# EAGLE board fp_32_v1 (EAGLE 8.4.1), part 1 of 3
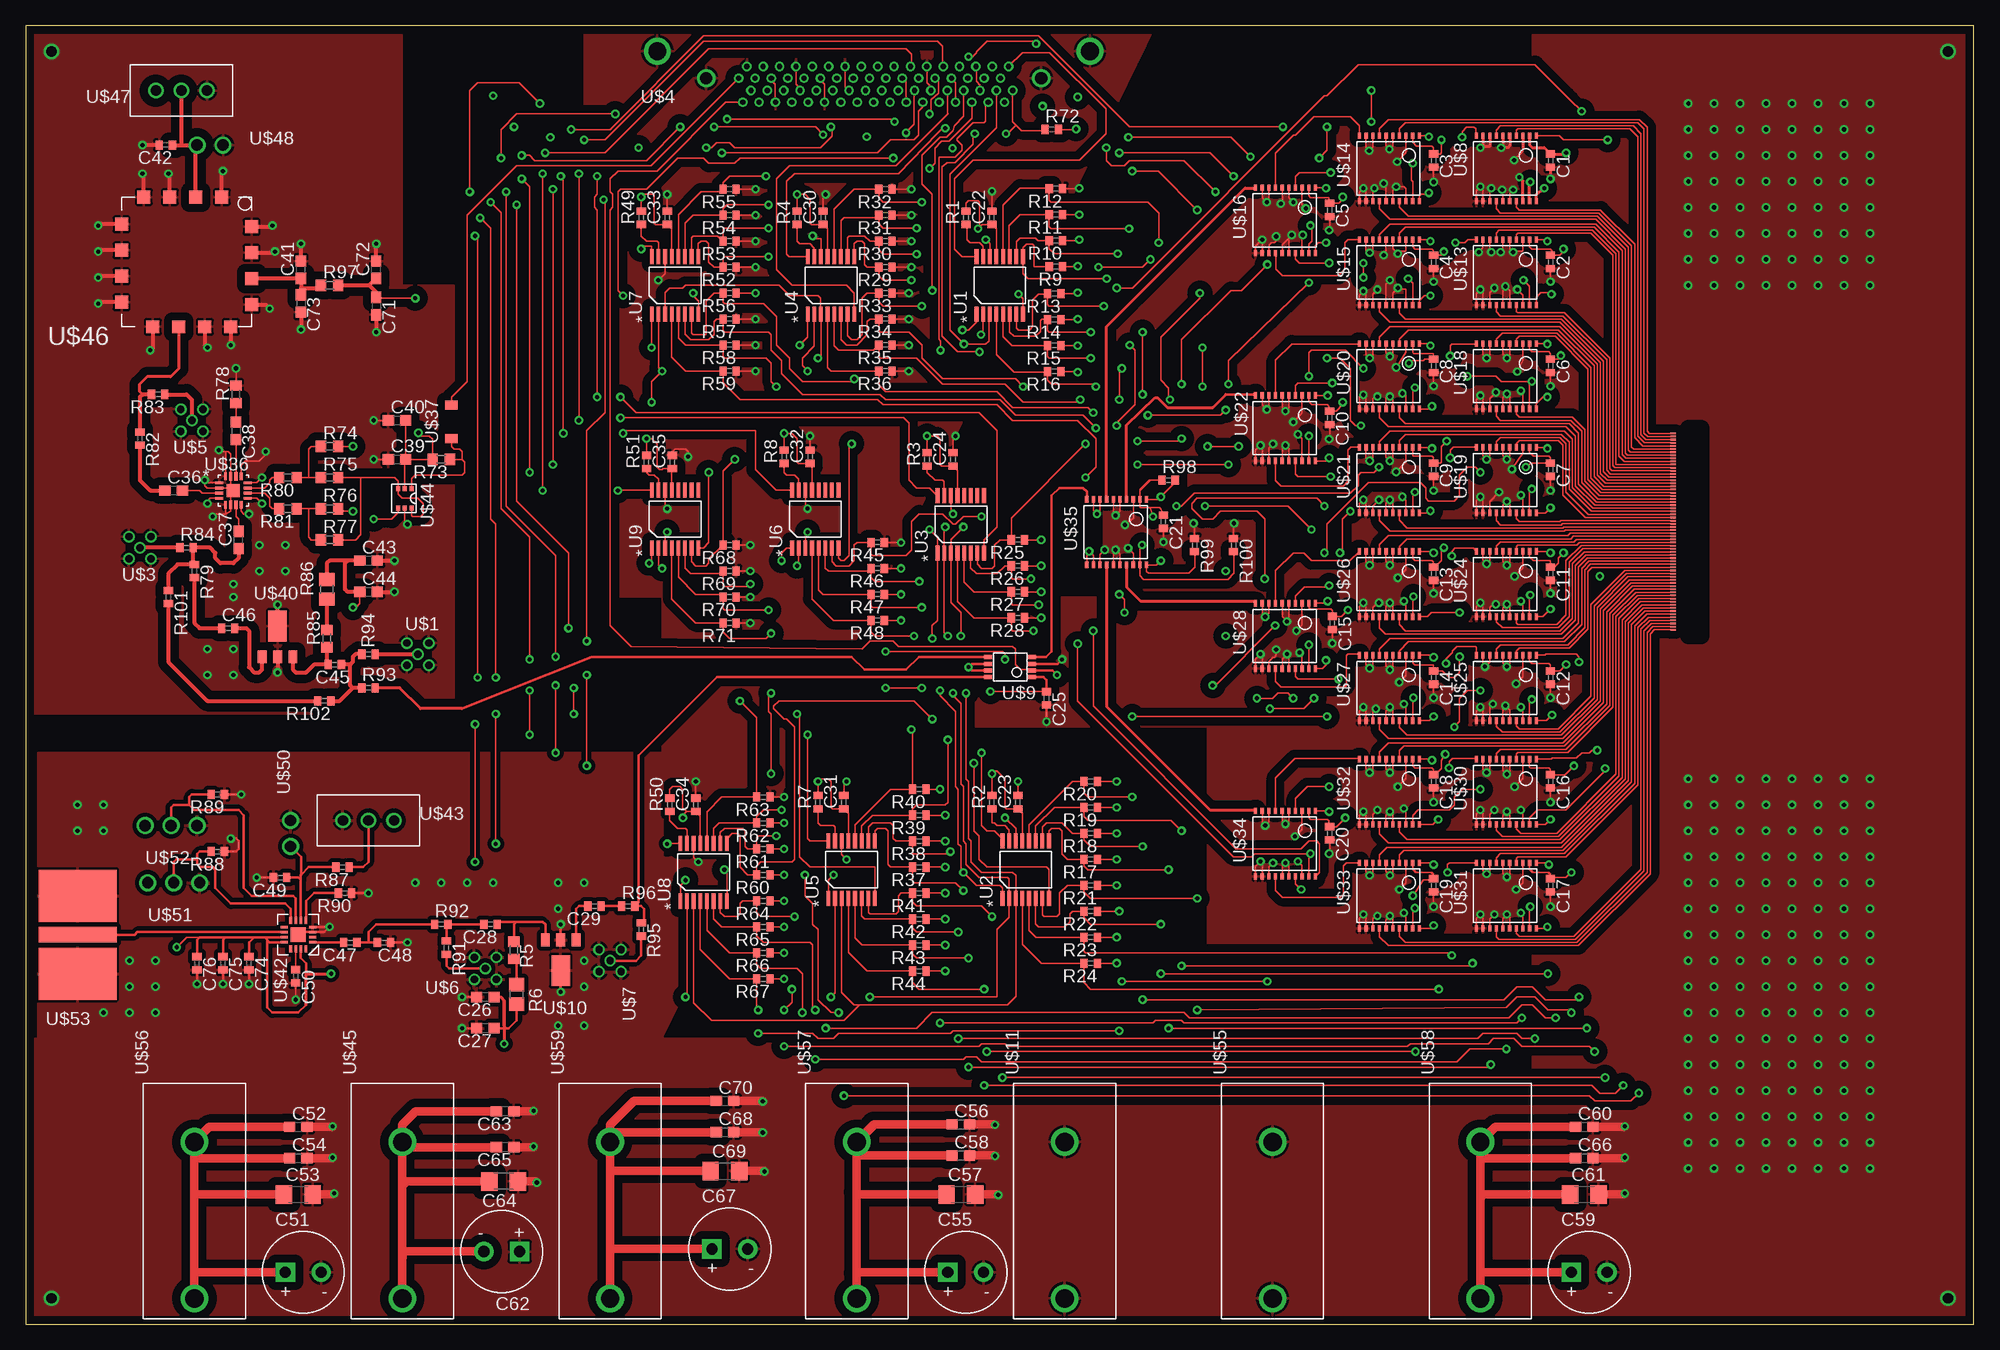
[diagram p14: board, top side]
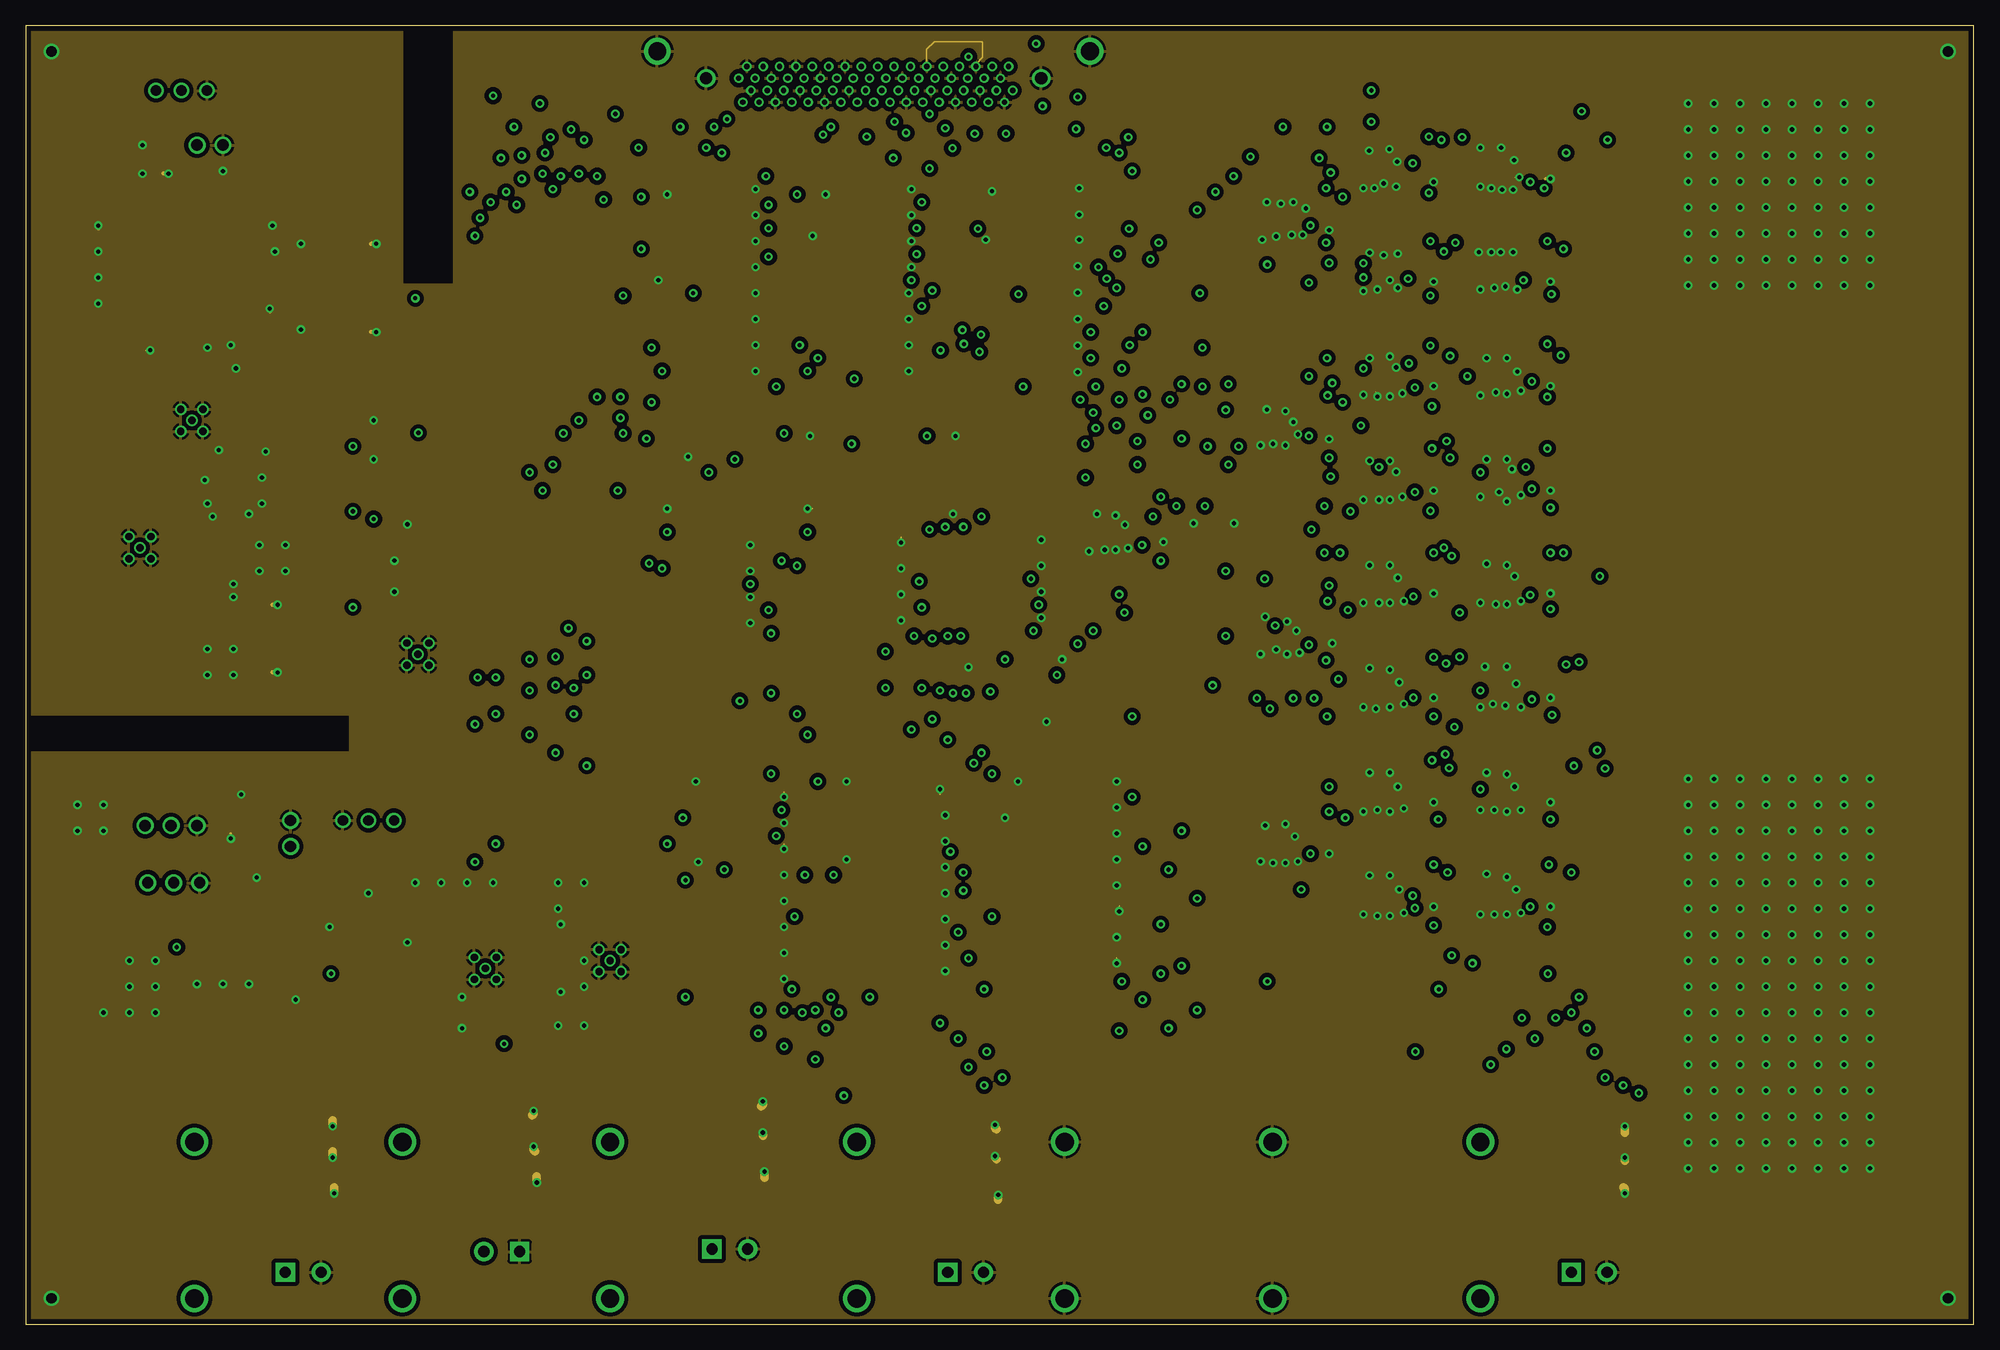
[diagram p15: board, inner layer Route2]
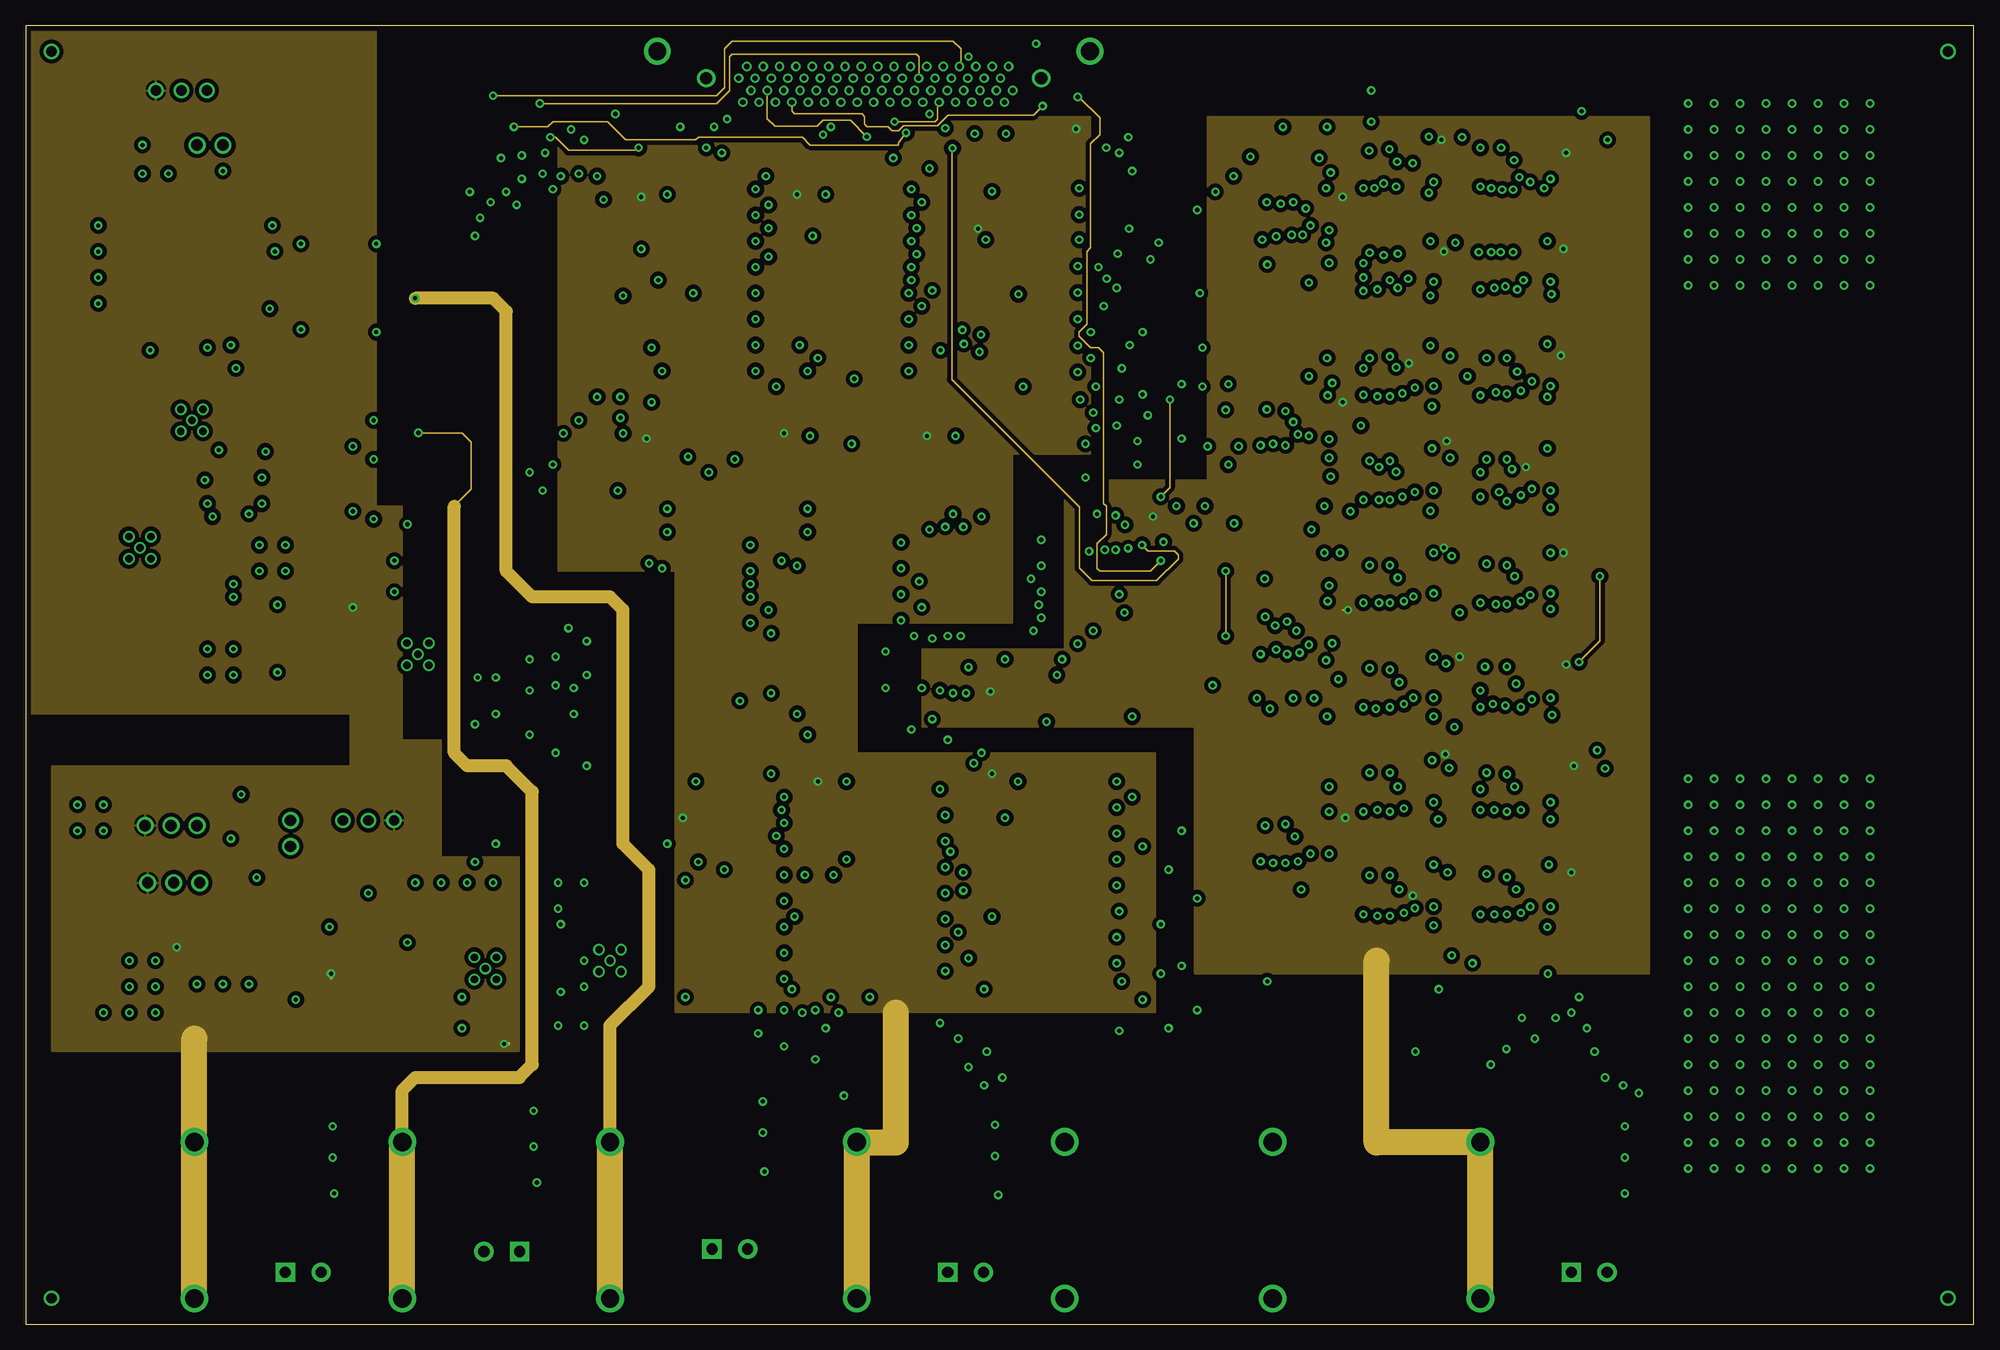
[diagram p16: board, inner layer Route15]
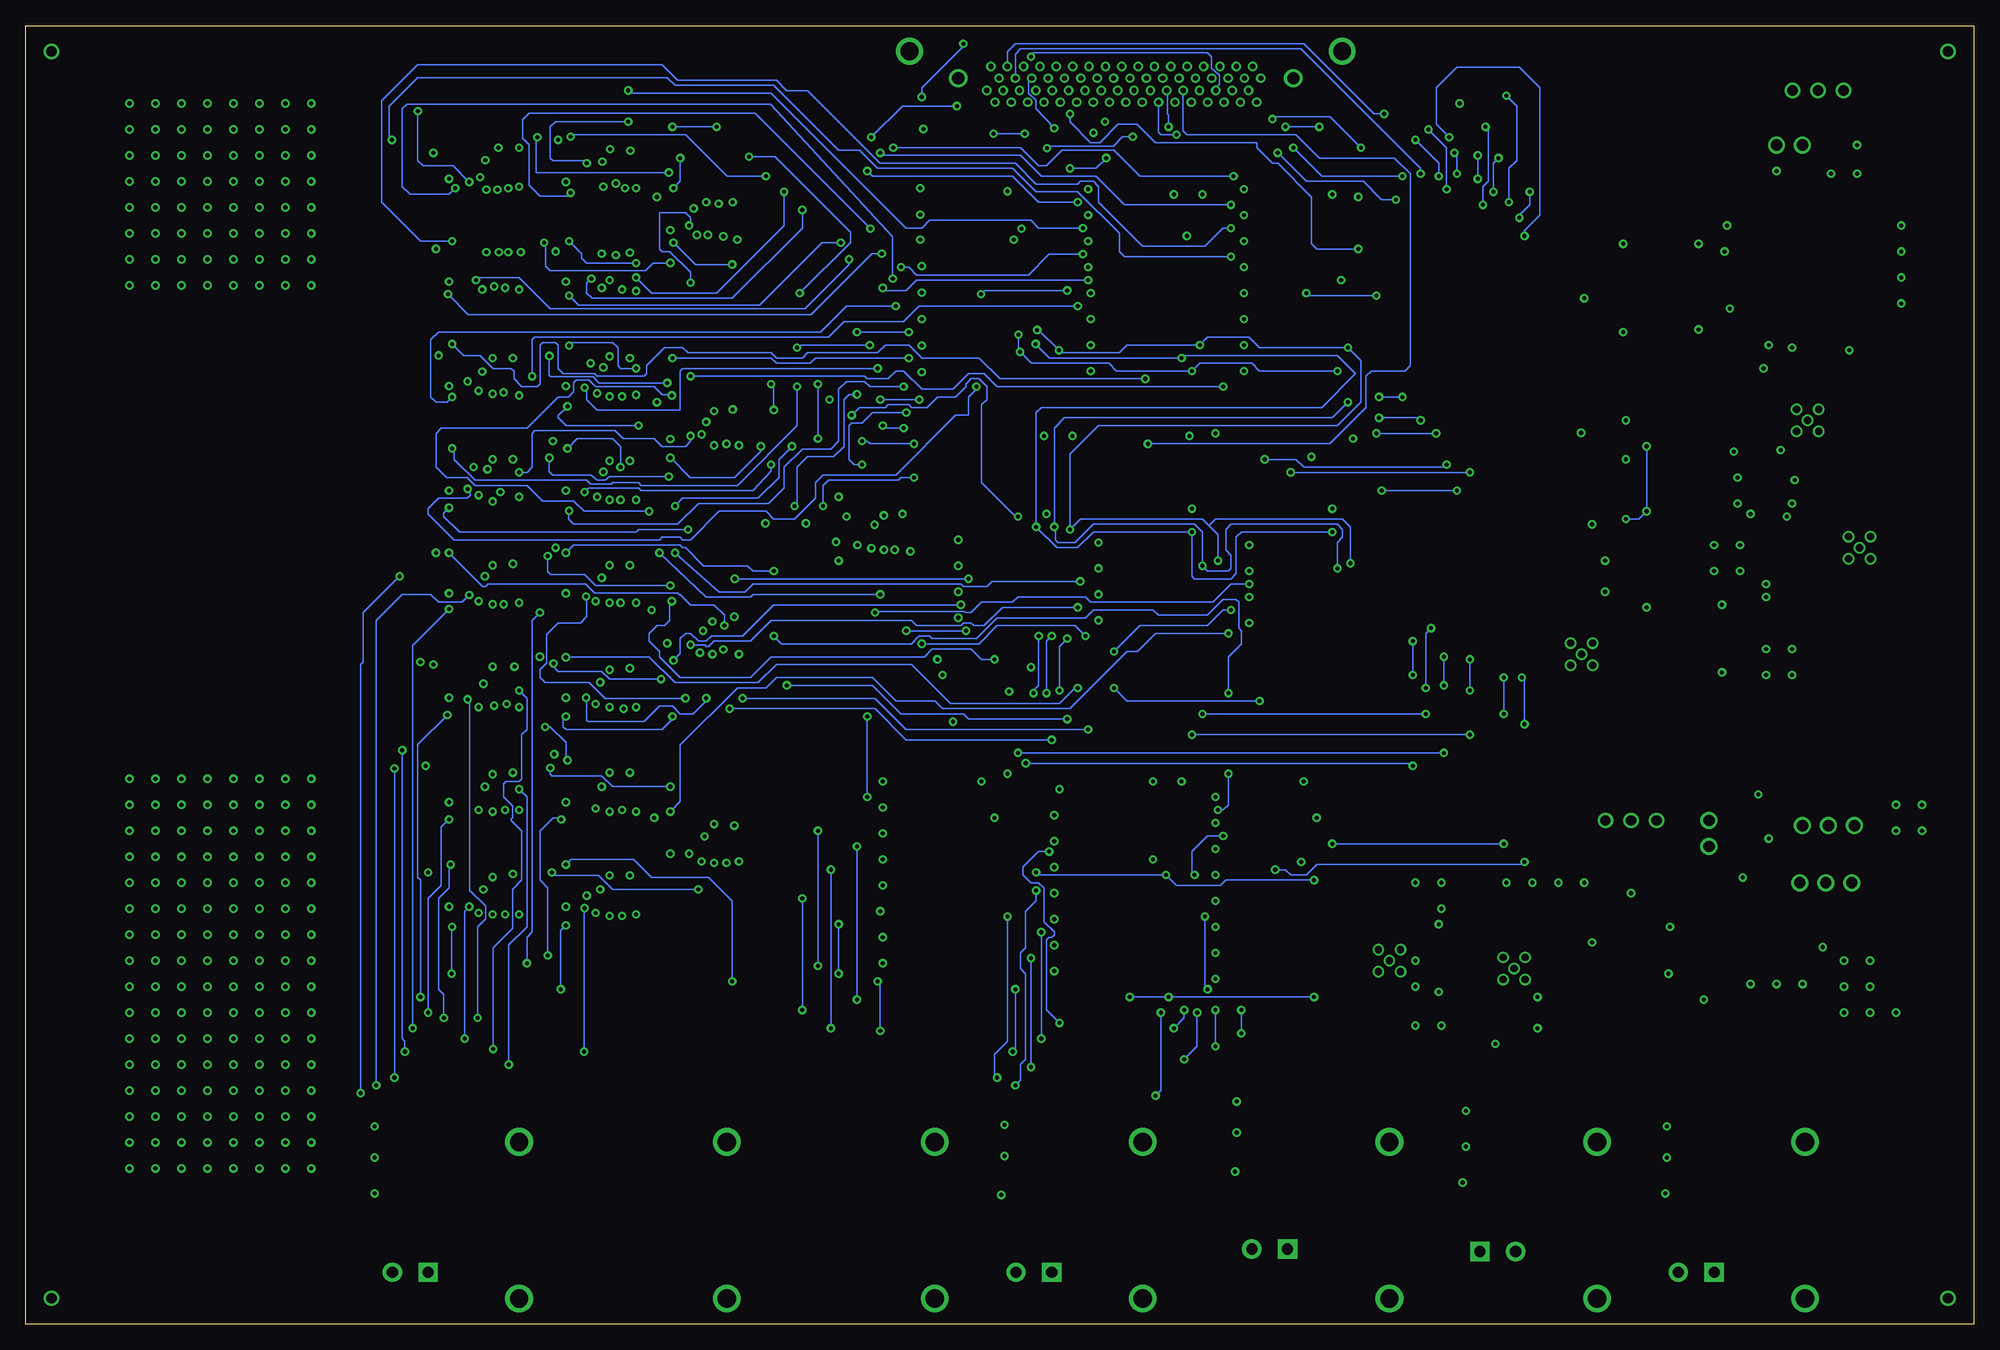
[diagram p17: board, bottom side, seen from below]

Size 190.5 x 127 mm. Coordinates in mm from the lower left corner, seen from the top.
Outline: 0,0 190.5,0 190.5,127 0,127 0,0
Copper layers (1+2*15+16): Top 0.0178mm / dielectric 12mil / Route2 0.0356mm / dielectric 28mil / Route15 0.0356mm / dielectric 12mil / Bottom 0.0178mm
Design rules "SSC-EAGLE-4Lyr_v1.0.0.3": minimum track width 6mil, minimum drill 8mil, track to track 6mil, track to pad 6mil, pad to pad 6mil, via to via 6mil, smd to smd 6mil, copper to edge 20mil, drill to drill 16mil, minimum pad ring 8mil, minimum via ring 8mil, stop-mask expansion 3mil, vias tented up to drill 0mil, thermal gap 10mil
tRestrict: area 162.6,67.3 to 163.8,87.6

## Footprints (pad centres in the part's own frame; a part is rotated, then mirrored left to right if it is on the bottom)
C0402 = smd 0.7 x 0.9: 1 -0.65,0; 2 0.65,0
C0603 = smd 1.1 x 1: 1 -0.85,0; 2 0.85,0
CAP_POL_RADIAL_8MM_3P5MMPAD = drill 1.087 pad 1.88 square: PIN+ 0,0 | drill 1.087 pad 1.88: PIN- 3.5,0
C1206 = smd 1.6 x 1.8: 1 -1.4,0; 2 1.4,0
R0402 = smd 0.7 x 0.9: 1 -0.65,0; 2 0.65,0
R0603 = smd 1 x 1.1: 1 -0.85,0; 2 0.85,0
R0805 = smd 1.3 x 1.5: 1 -0.95,0; 2 0.95,0
RU_16 = smd 1.473 x 0.356: 1 -2.819,2.275; 2 -2.819,1.625; 3 -2.819,0.975; 4 -2.819,0.325; 5 -2.819,-0.325; 6 -2.819,-0.975; 7 -2.819,-1.625; 8 -2.819,-2.275; 9 2.819,-2.275; 10 2.819,-1.625; 11 2.819,-0.975; 12 2.819,-0.325; 13 2.819,0.325; 14 2.819,0.975; 15 2.819,1.625; 16 2.819,2.275
MINISMP_PE44970_THRU_HOLE = drill 0.711: GND1 -1.079,1.079; GND2 1.079,1.079; GND3 1.079,-1.079; GND4 -1.079,-1.079; SIG 0,0
FP_BOND_6MIL = smd 0.508 x 0.152: P$1 0,0; P$2 0,-0.305; P$3 0,-0.61; P$4 0,-0.914; P$5 0,-1.219; P$6 0,-1.524; P$7 0,-1.829; P$8 0,-2.134; P$9 0,-2.438; P$10 0,-2.743; P$11 0,-3.048; P$12 0,-3.353; P$13 0,-3.658; P$14 0,-3.962; P$15 0,-4.267; P$16 0,-4.572
VHCDI_DIGILENT_V1 = drill 1.2: G1 -2.775,-1.2; G2 29.975,-1.2 | drill 1.75: G3 -7.55,-3.825; G4 34.75,-3.825 | drill 0.508 pad 0.813: P1 0,0; P2 0.8,1.15; P3 1.6,0; P4 2.4,1.15; P5 3.2,0; P6 4,1.15; P7 4.8,0; P8 5.6,1.15; P9 6.4,0; P10 7.2,1.15; P11 8,0; P12 8.8,1.15; P13 9.6,0; P14 10.4,1.15; P15 11.2,0; P16 12,1.15; P17 12.8,0; P18 13.6,1.15; P19 14.4,0; P20 15.2,1.15; P21 16,0; P22 16.8,1.15; P23 17.6,0; P24 18.4,1.15; P25 19.2,0; P26 20,1.15; P27 20.8,0; P28 21.6,1.15; P29 22.4,0; P30 23.2,1.15; P31 24,0; P32 24.8,1.15; P33 25.6,0; P34 26.4,1.15; P35 0.4,-2.35; P36 1.2,-1.2; P37 2,-2.35; P38 2.8,-1.2; P39 3.6,-2.35; P40 4.4,-1.2; P41 5.2,-2.35; P42 6,-1.2; P43 6.8,-2.35; P44 7.6,-1.2; P45 8.4,-2.35; P46 9.2,-1.2; P47 10,-2.35; P48 10.8,-1.2; P49 11.6,-2.35; P50 12.4,-1.2; P51 13.2,-2.35; P52 14,-1.2; P53 14.8,-2.35; P54 15.6,-1.2; P55 16.4,-2.35; P56 17.2,-1.2; P57 18,-2.35; P58 18.8,-1.2; P59 19.6,-2.35; P60 20.4,-1.2; P61 21.2,-2.35; P62 22,-1.2; P63 22.8,-2.35; P64 23.6,-1.2; P65 24.4,-2.35; P66 25.2,-1.2; P67 26,-2.35; P68 26.8,-1.2
TICLIB2_ADG904_TSSOP = smd 0.61 x 0.305: P$1 -3.2,2.925; P$2 -3.2,2.275; P$3 -3.2,1.625; P$4 -3.2,0.975; P$5 -3.2,0.325; P$6 -3.2,-0.325; P$7 -3.2,-0.975; P$8 -3.2,-1.625; P$9 -3.2,-2.275; P$10 -3.2,-2.925; P$11 3.2,-2.925; P$12 3.2,-2.275; P$13 3.2,-1.625; P$14 3.2,-0.975; P$15 3.2,-0.325; P$16 3.2,0.325; P$17 3.2,0.975; P$18 3.2,1.625; P$19 3.2,2.275; P$20 3.2,2.925
TIC_TESTING_ADG918BRMZ-500RL7CT-ND = smd 0.8 x 0.4: P$1 -2.15,0.975; P$2 -2.15,0.325; P$3 -2.15,-0.325; P$4 -2.15,-0.975; P$5 2.15,-0.975; P$6 2.15,-0.325; P$7 2.15,0.325; P$8 2.15,0.975
TO243AA/SOT89 = smd 0.86 x 1.27: P1 -1.5,0; P2 0,0; P3 1.5,0 | smd 1.8 x 3: P4 0,3
DELTRON_BANANA = drill 1.8: A 0,0; B 15.3,0
CP_16_3 = smd 0.762 x 0.254: 1 -1.397,0.762; 4 -1.397,-0.762; 9 1.397,-0.762; 12 1.397,0.762 | smd 0.813 x 0.305: 2 -1.397,0.254; 3 -1.397,-0.254; 10 1.397,-0.254; 11 1.397,0.254 | smd 0.254 x 0.762: 5 -0.762,-1.397; 8 0.762,-1.397; 13 0.762,1.397; 16 -0.762,1.397 | smd 0.305 x 0.813: 6 -0.254,-1.397; 7 0.254,-1.397; 14 0.254,1.397; 15 -0.254,1.397 | smd 1.27 x 1.27: 17 0,0
SOD123 = smd 0.914 x 1.219: A 0,0; C 3.277,0
QFN16 = smd 1.45 x 1.45: EP 0,0 | smd 0.7 x 0.25: P$1 -1.4,0.75; P$2 -1.4,0.25; P$3 -1.4,-0.25; P$4 -1.4,-0.75; P$9 1.4,-0.75; P$10 1.4,-0.25; P$11 1.4,0.25; P$12 1.4,0.75 | smd 0.25 x 0.7: P$5 -0.75,-1.4; P$6 -0.25,-1.4; P$7 0.25,-1.4; P$8 0.75,-1.4; P$13 0.75,1.4; P$14 0.25,1.4; P$15 -0.25,1.4; P$16 -0.75,1.4
PV36W502C01B00_5KTRIMMER = drill 1: 1 2.5,0; 2 0,0; 3 -2.5,0
FAIRCHILD_DUAL_INVERTER_NC7WZ04P6X = smd 0.4 x 0.5: 1 -0.65,-0.95; 2 0,-0.95; 3 0.65,-0.95; 4 0.65,0.95; 5 0,0.95; 6 -0.65,0.95
CVCO55BE-1000-1500_VCO = smd 1.27 x 1.27: P$1 2.921,0; P$2 5.461,0; P$3 8.001,0; P$4 10.541,0; P$5 12.7,2.667; P$6 12.7,5.207; P$7 12.7,7.747; P$8 12.7,10.287; P$9 9.652,12.7; P$10 7.112,12.7; P$11 4.572,12.7; P$12 2.032,12.7; P$13 0,10.541; P$14 0,8.001; P$15 0,5.461; P$16 0,2.921
HEADER_0.1''_1X2 = drill 1.1: 1 -1.27,0; 2 1.27,0
HEADER_0.1''_1X3 = drill 1.1: 1 -2.54,0; 2 0,0; 3 2.54,0
SMA_CONN_SIDE = smd 7.62 x 1.524: CENTER 0,0 | smd 7.62 x 5.08: GND1 0,3.81; GND2 0,-3.81

## Placement (x,y rotation side)
C1  0.1uF0402  [C0402]  149.1,113.79 270 top
C2  0.1uF0402  [C0402]  149.1,103.89 270 top
C3  0.1uF0402  [C0402]  137.67,113.79 270 top
C4  0.1uF0402  [C0402]  137.67,103.89 270 top
C5  0.1uF0402  [C0402]  127.51,108.97 270 top
C6  0.1uF0402  [C0402]  149.1,93.73 270 top
C7  0.1uF0402  [C0402]  149.1,83.57 270 top
C8  0.1uF0402  [C0402]  137.67,93.73 270 top
C9  0.1uF0402  [C0402]  137.67,83.57 270 top
C10  0.1uF0402  [C0402]  127.51,88.65 270 top
C11  0.1uF0402  [C0402]  149.1,73.41 270 top
C12  0.1uF0402  [C0402]  149.1,63.25 270 top
C13  0.1uF0402  [C0402]  137.67,73.41 270 top
C14  0.1uF0402  [C0402]  137.67,63.25 270 top
C15  0.1uF0402  [C0402]  127.76,68.58 270 top
C16  0.1uF0402  [C0402]  149.1,53.09 270 top
C17  0.1uF0402  [C0402]  149.1,42.93 270 top
C18  0.1uF0402  [C0402]  137.67,53.09 270 top
C19  0.1uF0402  [C0402]  137.67,42.93 270 top
C20  0.1uF0402  [C0402]  127.51,48.01 270 top
C21  0.1uF0402  [C0402]  111.25,78.49 270 top
C22  0.1uF0402  [C0402]  94.49,108.2 90 top
C23  0.1uF0402  [C0402]  97.03,51.05 90 top
C24  0.1uF0402  [C0402]  90.68,84.58 90 top
C25  0.1uF0402  [C0402]  99.82,61.21 270 top
C26  100pF  [C0603]  44.96,32 180 top
C27  1uF  [C0603]  44.96,28.96 180 top
C28  100pF/0402  [C0402]  45.47,39.12 180 top
C29  100pF/0402  [C0402]  55.63,40.89 180 top
C30  0.1uF0402  [C0402]  77.98,108.2 90 top
C31  0.1uF0402  [C0402]  80.01,51.05 90 top
C32  0.1uF0402  [C0402]  76.71,84.84 90 top
C33  0.1uF0402  [C0402]  62.74,108.2 90 top
C34  0.1uF0402  [C0402]  65.53,50.8 90 top
C35  0.1uF0402  [C0402]  63.25,84.33 90 top
C36  100nF  [C0603]  14.48,81.53 0 top
C37  100nF  [C0603]  20.83,76.71 90 top
C38  100nF  [C0603]  20.57,87.38 270 top
C39  0.1uF  [C0603]  36.32,84.58 0 top
C40  0.01uF  [C0603]  36.32,88.39 0 top
C41  0.1uF  [C0603]  26.92,103.12 90 top
C42  0.1uF0402  [C0402]  13.72,115.32 180 top
C43  100pF  [C0603]  33.53,74.68 0 top
C44  1uF  [C0603]  33.53,71.63 0 top
C45  100pF/0402  [C0402]  30.23,64.52 0 top
C46  100pF/0402  [C0402]  19.81,68.07 0 top
C47  100pF  [C0402]  31.75,37.34 180 top
C48  6.8nH  [C0402]  35.05,37.34 0 top
C49  0.1uF0402  [C0402]  24.89,43.69 180 top
C50  100pF  [C0402]  26.42,34.04 270 top
C51  100uF  [CAP_POL_RADIAL_8MM_3P5MMPAD]  25.4,5.08 0 top
C52  2.2uF  [C0603]  26.67,19.3 0 top
C53  10uF  [C1206]  26.67,12.7 0 top
C54  0.1uF  [C0603]  26.67,16.26 0 top
C55  100uF  [CAP_POL_RADIAL_8MM_3P5MMPAD]  90.17,5.08 0 top
C56  2.2uF  [C0603]  91.44,19.56 0 top
C57  10uF  [C1206]  91.44,12.7 0 top
C58  0.1uF  [C0603]  91.44,16.51 0 top
C59  100uF  [CAP_POL_RADIAL_8MM_3P5MMPAD]  151.13,5.08 0 top
C60  2.2uF  [C0603]  152.4,19.3 0 top
C61  10uF  [C1206]  152.4,12.7 0 top
C62  100uF  [CAP_POL_RADIAL_8MM_3P5MMPAD]  48.31,7.11 180 top
C63  2.2uF  [C0603]  46.89,20.83 180 top
C64  10uF  [C1206]  46.74,13.97 180 top
C65  0.1uF  [C0603]  46.89,17.32 180 top
C66  0.1uF  [C0603]  152.4,16.26 0 top
C67  100uF  [CAP_POL_RADIAL_8MM_3P5MMPAD]  67.11,7.37 0 top
C68  2.2uF  [C0603]  68.38,18.8 0 top
C69  10uF  [C1206]  68.38,14.99 0 top
C70  0.1uF  [C0603]  68.38,21.84 0 top
C71  0.1uF  [C0603]  34.29,99.57 270 top
C72  2.2uF  [C0603]  34.29,103.12 90 top
C73  2.2uF  [C0603]  26.92,99.82 270 top
C74  10pF  [C0402]  21.84,35.31 270 top
C75  100pF  [C0402]  19.3,35.31 270 top
C76  1000pF  [C0402]  16.76,35.31 270 top
R1  2k 0402  [R0402]  91.95,108.2 90 top
R2  2k 0402  [R0402]  94.49,51.05 90 top
R3  2k 0402  [R0402]  88.14,84.58 90 top
R4  2k 0402  [R0402]  75.44,108.2 90 top
R5  100nH  [R0603]  47.75,36.58 270 top
R6  22  [R0805]  48.01,32.26 270 top
R7  2k 0402  [R0402]  77.47,51.05 90 top
R8  2k 0402  [R0402]  74.17,84.84 90 top
R9  2k 0402  [R0402]  100.74,103.43 180 top
R10  2k 0402  [R0402]  100.74,105.97 180 top
R11  2k 0402  [R0402]  100.74,108.51 180 top
R12  2k 0402  [R0402]  100.74,111.05 180 top
R13  2k 0402  [R0402]  100.58,100.79 180 top
R14  2k 0402  [R0402]  100.58,98.25 180 top
R15  2k 0402  [R0402]  100.58,95.71 180 top
R16  2k 0402  [R0402]  100.58,93.17 180 top
R17  2k 0402  [R0402]  104.14,45.47 180 top
R18  2k 0402  [R0402]  104.14,48.01 180 top
R19  2k 0402  [R0402]  104.14,50.55 180 top
R20  2k 0402  [R0402]  104.14,53.09 180 top
R21  2k 0402  [R0402]  104.14,42.93 180 top
R22  2k 0402  [R0402]  104.14,40.39 180 top
R23  2k 0402  [R0402]  104.14,37.85 180 top
R24  2k 0402  [R0402]  104.14,35.31 180 top
R25  2k 0402  [R0402]  97.03,76.71 180 top
R26  2k 0402  [R0402]  97.03,74.17 180 top
R27  2k 0402  [R0402]  97.03,71.63 180 top
R28  2k 0402  [R0402]  97.03,69.09 180 top
R29  2k 0402  [R0402]  84.07,103.38 180 top
R30  2k 0402  [R0402]  84.07,105.92 180 top
R31  2k 0402  [R0402]  84.07,108.46 180 top
R32  2k 0402  [R0402]  84.07,111 180 top
R33  2k 0402  [R0402]  84.07,100.84 180 top
R34  2k 0402  [R0402]  84.07,98.3 180 top
R35  2k 0402  [R0402]  84.07,95.76 180 top
R36  2k 0402  [R0402]  84.07,93.22 180 top
R37  2k 0402  [R0402]  87.38,44.7 180 top
R38  2k 0402  [R0402]  87.38,47.24 180 top
R39  2k 0402  [R0402]  87.38,49.78 180 top
R40  2k 0402  [R0402]  87.38,52.32 180 top
R41  2k 0402  [R0402]  87.38,42.16 180 top
R42  2k 0402  [R0402]  87.38,39.62 180 top
R43  2k 0402  [R0402]  87.38,37.08 180 top
R44  2k 0402  [R0402]  87.38,34.54 180 top
R45  2k 0402  [R0402]  83.31,76.45 180 top
R46  2k 0402  [R0402]  83.31,73.91 180 top
R47  2k 0402  [R0402]  83.31,71.37 180 top
R48  2k 0402  [R0402]  83.31,68.83 180 top
R49  2k 0402  [R0402]  60.2,108.2 90 top
R50  2k 0402  [R0402]  62.99,50.8 90 top
R51  2k 0402  [R0402]  60.71,84.33 90 top
R52  2k 0402  [R0402]  68.83,103.38 180 top
R53  2k 0402  [R0402]  68.83,105.92 180 top
R54  2k 0402  [R0402]  68.83,108.46 180 top
R55  2k 0402  [R0402]  68.83,111 180 top
R56  2k 0402  [R0402]  68.83,100.84 180 top
R57  2k 0402  [R0402]  68.83,98.3 180 top
R58  2k 0402  [R0402]  68.83,95.76 180 top
R59  2k 0402  [R0402]  68.83,93.22 180 top
R60  2k 0402  [R0402]  72.14,43.94 180 top
R61  2k 0402  [R0402]  72.14,46.48 180 top
R62  2k 0402  [R0402]  72.14,49.02 180 top
R63  2k 0402  [R0402]  72.14,51.56 180 top
R64  2k 0402  [R0402]  72.14,41.4 180 top
R65  2k 0402  [R0402]  72.14,38.86 180 top
R66  2k 0402  [R0402]  72.14,36.32 180 top
R67  2k 0402  [R0402]  72.14,33.78 180 top
R68  2k 0402  [R0402]  68.83,76.2 180 top
R69  2k 0402  [R0402]  68.83,73.66 180 top
R70  2k 0402  [R0402]  68.83,71.12 180 top
R71  2k 0402  [R0402]  68.83,68.58 180 top
R72  2k 0402  [R0402]  100.33,116.84 0 top
R73  10k  [R0603]  40.64,84.58 180 top
R74  0  [R0603]  29.72,85.85 0 top
R75  0  [R0603]  29.72,82.8 0 top
R76  0  [R0603]  29.72,79.76 0 top
R77  0  [R0603]  29.72,76.71 0 top
R78  50  [R0603]  20.57,90.93 90 top
R79  0 0402  [R0402]  16.51,73.66 270 top
R80  0  [R0603]  25.65,82.8 180 top
R81  0  [R0603]  25.65,79.76 180 top
R82  0 0402  [R0402]  11.18,86.61 270 top
R83  0 0402  [R0402]  12.95,90.93 180 top
R84  0 0402  [R0402]  15.75,75.95 0 top
R85  100nH  [R0603]  29.46,67.06 90 top
R86  22  [R0805]  29.46,71.88 90 top
R87  0 0402  [R0402]  30.99,44.7 180 top
R88  10k0402  [R0402]  18.8,46.23 180 top
R89  10k0402  [R0402]  18.8,51.82 180 top
R90  10k0402  [R0402]  31.24,42.16 180 top
R91  0 0402  [R0402]  41.15,36.83 270 top
R92  0 0402  [R0402]  40.64,39.12 0 top
R93  0 0402  [R0402]  33.53,62.23 0 top
R94  0 0402  [R0402]  33.53,65.53 0 top
R95  0 0402  [R0402]  60.2,38.61 270 top
R96  0 0402  [R0402]  58.93,40.89 0 top
R97  FERRITE  [R0603]  29.72,101.6 0 top
R98  10k  [R0402]  111.76,82.55 0 top
R99  10k  [R0402]  114.3,76.2 270 top
R100  10k  [R0402]  118.11,76.2 270 top
R101  0 0402  [R0402]  13.97,71.12 270 top
R102  0 0402  [R0402]  29.21,60.96 180 top
U1  ADG738BRUZ  [RU_16]  95.25,101.6 90 top
U2  ADG738BRUZ  [RU_16]  97.79,44.45 90 top
U3  ADG738BRUZ  [RU_16]  91.44,78.23 90 top
U4  ADG738BRUZ  [RU_16]  78.74,101.6 90 top
U5  ADG738BRUZ  [RU_16]  80.77,44.45 90 top
U6  ADG738BRUZ  [RU_16]  77.22,78.74 90 top
U7  ADG738BRUZ  [RU_16]  63.5,101.6 90 top
U8  ADG738BRUZ  [RU_16]  66.29,44.2 90 top
U9  ADG738BRUZ  [RU_16]  63.5,78.74 90 top
U$1  MINISMP_PE44970_THRUHOLE  [MINISMP_PE44970_THRU_HOLE]  38.35,65.53 270 top
U$2  FP-BOND-6MIL  [FP_BOND_6MIL]  161.09,87.12 0 top
U$3  MINISMP_PE44970_THRUHOLE  [MINISMP_PE44970_THRU_HOLE]  11.18,75.95 0 top
U$4  VHDCI_DIGILENT_V1  [VHCDI_DIGILENT_V1]  96.52,120.65 180 top
U$5  MINISMP_PE44970_THRUHOLE  [MINISMP_PE44970_THRU_HOLE]  16.26,88.39 180 top
U$6  MINISMP_PE44970_THRUHOLE  [MINISMP_PE44970_THRU_HOLE]  44.96,34.8 180 top
U$7  MINISMP_PE44970_THRUHOLE  [MINISMP_PE44970_THRU_HOLE]  57.15,35.56 270 top
U$8  TICLIB2_ADG904  [TICLIB2_ADG904_TSSOP]  144.78,113.03 270 top
U$9  TIC_TESTING_ADG918BRMZ-500RL7CT  [TIC_TESTING_ADG918BRMZ-500RL7CT-ND]  96.27,64.26 180 top
U$10  RF3378_AMPLIFIER  [TO243AA/SOT89]  52.32,37.59 180 top
U$11  DELTRON_BANANA  [DELTRON_BANANA]  101.6,2.54 90 top
U$13  TICLIB2_ADG904  [TICLIB2_ADG904_TSSOP]  144.78,102.87 270 top
U$14  TICLIB2_ADG904  [TICLIB2_ADG904_TSSOP]  133.35,113.03 270 top
U$15  TICLIB2_ADG904  [TICLIB2_ADG904_TSSOP]  133.35,102.87 270 top
U$16  TICLIB2_ADG904  [TICLIB2_ADG904_TSSOP]  123.19,107.95 270 top
U$17  FP-BOND-6MIL  [FP_BOND_6MIL]  161.09,82.25 0 top
U$18  TICLIB2_ADG904  [TICLIB2_ADG904_TSSOP]  144.78,92.71 270 top
U$19  TICLIB2_ADG904  [TICLIB2_ADG904_TSSOP]  144.78,82.55 270 top
U$20  TICLIB2_ADG904  [TICLIB2_ADG904_TSSOP]  133.35,92.71 270 top
U$21  TICLIB2_ADG904  [TICLIB2_ADG904_TSSOP]  133.35,82.55 270 top
U$22  TICLIB2_ADG904  [TICLIB2_ADG904_TSSOP]  123.19,87.63 270 top
U$23  FP-BOND-6MIL  [FP_BOND_6MIL]  161.09,77.37 0 top
U$24  TICLIB2_ADG904  [TICLIB2_ADG904_TSSOP]  144.78,72.39 270 top
U$25  TICLIB2_ADG904  [TICLIB2_ADG904_TSSOP]  144.78,62.23 270 top
U$26  TICLIB2_ADG904  [TICLIB2_ADG904_TSSOP]  133.35,72.39 270 top
U$27  TICLIB2_ADG904  [TICLIB2_ADG904_TSSOP]  133.35,62.23 270 top
U$28  TICLIB2_ADG904  [TICLIB2_ADG904_TSSOP]  123.19,67.31 270 top
U$29  FP-BOND-6MIL  [FP_BOND_6MIL]  161.09,72.49 0 top
U$30  TICLIB2_ADG904  [TICLIB2_ADG904_TSSOP]  144.78,52.07 270 top
U$31  TICLIB2_ADG904  [TICLIB2_ADG904_TSSOP]  144.78,41.91 270 top
U$32  TICLIB2_ADG904  [TICLIB2_ADG904_TSSOP]  133.35,52.07 270 top
U$33  TICLIB2_ADG904  [TICLIB2_ADG904_TSSOP]  133.35,41.91 270 top
U$34  TICLIB2_ADG904  [TICLIB2_ADG904_TSSOP]  123.19,46.99 270 top
U$35  TICLIB2_ADG904  [TICLIB2_ADG904_TSSOP]  106.68,77.47 270 top
U$36  RF_SWITCH_SPDT_HMC547LP3  [CP_16_3]  20.32,81.53 0 top
U$37  ZENER_MMSZ4689-TP  [SOD123]  41.66,86.61 90 top
U$40  RF3378_AMPLIFIER  [TO243AA/SOT89]  24.64,65.28 0 top
U$42  LTC_5564_ENV_DET  [QFN16]  26.67,38.1 180 top
U$43  PV36W502C01B00_5KTRIMMER  [PV36W502C01B00_5KTRIMMER]  33.53,49.28 0 top
U$44  FAIRCHILD_UHS_DUAL_INVERTER_NC7WZ04P6X  [FAIRCHILD_DUAL_INVERTER_NC7WZ04P6X]  37.08,80.77 180 top
U$45  DELTRON_BANANA  [DELTRON_BANANA]  36.83,2.54 90 top
U$46  CVCO55BE-1000-1500_VCO  [CVCO55BE-1000-1500_VCO]  22.1,110.24 180 top
U$47  PV36W502C01B00_5KTRIMMER  [PV36W502C01B00_5KTRIMMER]  15.24,120.65 180 top
U$48  HEADER_0.1''_1X2  [HEADER_0.1''_1X2]  18.03,115.32 0 top
U$50  HEADER_0.1''_1X2  [HEADER_0.1''_1X2]  25.91,48.01 90 top
U$51  HEADER_0.1''_1X3  [HEADER_0.1''_1X3]  14.48,43.18 0 top
U$52  HEADER_0.1''_1X3  [HEADER_0.1''_1X3]  14.22,48.77 0 top
U$53  SMA_CONN_SIDE  [SMA_CONN_SIDE]  5.08,38.1 180 top
U$55  DELTRON_BANANA  [DELTRON_BANANA]  121.92,2.54 90 top
U$56  DELTRON_BANANA  [DELTRON_BANANA]  16.51,2.54 90 top
U$57  DELTRON_BANANA  [DELTRON_BANANA]  81.28,2.54 90 top
U$58  DELTRON_BANANA  [DELTRON_BANANA]  142.24,2.54 90 top
U$59  DELTRON_BANANA  [DELTRON_BANANA]  57.15,2.54 90 top

## Tracks (layer width: path | path; a pad name or v marks a point on that pad's centre or on a via)
+3V3  (via drill 0.41)
  Top 0.152: U1.13 94.92,107.12 C22.1 93.53,107.55 v93.12,107.14 93.27,107.29 93.27,109.73 93.12,109.88 92.2,109.88 91.95,109.63 R1.2 | R72.2 102.67,116.84 v102.72,116.89 | U4.13 78.42,107.12 C30.1 76.85,107.55 76.71,107.7 76.71,109.98 76.2,110.49 v75.44,110.49 R4.2 | U7.13 63.17,107.12 C33.1 61.61,107.55 61.47,107.7 61.47,110.49 60.45,110.49 v60.2,110.24 R49.2 | U3.13 91.11,83.5 C24.1 89.55,83.93 89.41,84.07 89.41,86.61 89.15,86.87 v88.14,86.87 R3.2 | U6.13 76.89,84 C32.1 75.58,84.19 75.44,84.33 75.44,86.61 74.93,87.12 v74.17,87.12 R8.2 | U9.13 63.17,83.61 C35.1 62.34,83.68 62.23,83.57 61.98,83.57 61.72,83.82 61.72,86.11 61.21,86.61 v60.71,86.61 R51.2 | U2.13 97.47,49.97 C23.1 95.9,50.4 95.76,50.55 95.76,53.34 95,54.1 94.74,54.1 v94.49,53.85 R2.2 | U5.13 80.45,49.97 C31.1 78.88,50.4 78.74,50.55 78.74,53.09 78.49,53.34 77.72,53.34 v77.47,53.09 R7.2 | U8.13 65.97,49.71 C34.1 64.63,50.15 | 64.63,50.15 64.26,49.78 v64.26,49.53 | R50.2 62.99,52.32 63.25,52.58 64.01,52.58 64.26,52.32 64.26,50.52 64.63,50.15
  Top 0.813: C56.1 83,19.56 | 83,19.56 U$57.B | 83,19.56 82.96,19.56 81.23,17.83 81.23,16.31 | 81.23,16.31 81.23,12.95 | 81.23,12.95 81.23,5.03 | 81.23,5.03 81.23,2.59 U$57.A | C55.PIN+ 81.28,5.08 81.23,5.03 | C57.1 81.48,12.7 81.23,12.95 | C58.1 81.43,16.51 81.23,16.31
  Route2 0.152: v102.72,116.89 102.72,116.74 | v74.17,87.12 73.91,87.12 | v77.47,53.09 77.22,53.09
  Route15 0.152: v93.12,107.14 92.96,107.14 | v75.44,110.49 75.18,110.49 | v60.2,110.24 59.94,110.24 | v88.14,86.87 87.88,86.87 | v60.71,86.61 60.45,86.36 | v94.49,53.85 94.23,53.85 | v64.26,49.53 64.01,49.53
  Route15 2.54: U$57.A 81.28,17.78 85.09,17.78 85.09,30.48
  pour Route15 (isolate 0.406): 52.07,118.11 104.14,118.11 104.14,85.09 96.52,85.09 96.52,68.58 81.28,68.58 81.28,55.88 110.49,55.88 110.49,30.48 63.5,30.48 63.5,73.66 52.07,73.66
+5V  (via drill 0.41)
  Top 0.152: 17.02,37.85 15.75,37.85 v14.78,36.88 | C44.1 32.68,70.47 32.31,70.1 v32,70.1
  Top 0.254: U$42.P$11 23.37,37.85 | 23.37,37.85 22.36,37.85 22.35,37.85 | 22.35,37.85 21.84,37.34 C74.1 | C75.1 19.3,37.59 19.56,37.85 | 19.56,37.85 22.35,37.85 | C76.1 16.76,37.59 17.02,37.85 19.56,37.85 | U$42.P$12 23.87,37.35 23.62,37.59 | 23.62,37.59 23.37,37.85 | U$42.P$15 26.92,35.82 27.43,35.31 27.43,34.29 | 27.43,31.24 26.67,30.48 24.13,30.48 23.62,30.99 23.62,37.59 | R6.2 48.01,29.72 47.24,28.96 46.99,28.96 | 46.99,28.96 C27.1 | 46.48,32 46.74,31.75 46.74,29.21 46.99,28.96
  Top 0.305: 27.43,31.24 27.43,34.29 v29.87,34.29 | C26.1 46.48,32 46.79,31.7 v46.79,27.43
  Top 0.406: C43.1 31.5,74.68 | 31.5,74.68 29.72,74.68 29.46,74.42 R86.2 | C44.1 31.5,71.63 31.24,71.88 31.24,74.42 31.5,74.68
  Top 0.813: C52.1 17.97,19.3 U$56.B 16.51,16.46 | U$56.A 16.51,5.18 | 16.51,5.18 16.51,12.65 | 16.51,12.65 16.51,16.46 | C51.PIN+ 16.61,5.08 16.51,5.18 | C53.1 16.56,12.7 16.51,12.65 | C54.1 16.71,16.26 16.51,16.46
  Route15 0.152: v14.78,36.88 14.63,36.88 | v32,70.1 32,70.26
  Route15 0.305: v29.87,34.29 29.87,33.83 | v46.79,27.43 47.24,27.43
  Route15 2.54: U$56.A 16.51,27.94
  pour Route15 (isolate 0.406): 0,127 34.29,127 34.29,80.01 36.83,80.01 36.83,57.15 40.64,57.15 40.64,45.72 48.26,45.72 48.26,26.67 2.54,26.67 2.54,54.61 31.75,54.61 31.75,59.69 0,59.69
-5V  (via drill 0.41)
  Top 0.152: C39.2 R73.2 39.79,86.55 39.47,86.87 38.71,86.87 v38.41,87.17 | U$44.2 37.08,84.49 C39.2 | C39.2 C40.2
  Top 0.813: C63.2 38.15,20.83 36.83,19.51 U$45.B | U$45.A 36.83,6.55 | 36.83,6.55 36.83,13.56 | 36.83,13.56 U$45.B | 36.83,6.55 36.88,6.5 36.88,7.16 44.76,7.16 C62.PIN- | C64.2 37.24,13.97 36.83,13.56 | C65.2 37.35,17.32 U$45.B
  Route15 0.152: v38.41,87.17 42.67,87.17 43.59,86.26 43.59,81.69 41.91,80.01
  Route15 1.27: U$45.B 36.83,22.86 38.1,24.13 48.26,24.13 49.53,25.4 49.53,52.07 46.99,54.61 43.18,54.61 41.91,55.88 41.91,80.01
  Route15 2.54: U$45.A 36.83,17.78
A0_1_1  (via drill 0.41)
  Top 0.152: R9.2 98.65,103.43 98.6,103.48 98.6,105.46 98.45,105.61 97.84,105.61 97.53,105.3 U1.9 97.53,102.73 97.99,102.26 v105.72,102.26
  Top 0.305: U$8.P$20 147.71,110.47 v148.49,111.1
  Bottom 0.152: v105.72,102.26 105.72,106.38 117.65,119.33 153.21,119.33 153.67,118.87 153.67,111.25 152.91,110.49 149.1,110.49 v148.49,111.1
A0_1_2  (via drill 0.41)
  Top 0.152: 147.71,100.41 U$13.P$20 147.71,100.46 148.13,100.89 149.05,100.89 v149.2,100.74 | U1.10 96.88,105.87 97.23,106.22 98.75,106.22 99.01,105.97 R10.2 100.09,105.2 100.58,104.7 v106.78,104.7
  Bottom 0.152: 149.05,100.74 v149.2,100.74 147.22,98.75 113.69,98.75 107.75,104.7 v106.78,104.7
A0_1_3  (via drill 0.41)
  Top 0.152: U$14.P$20 136.28,110.32 136.45,110.49 137.06,110.49 v137.21,110.64 | U1.11 96.16,104.48 96.16,107.44 97.23,108.51 R11.2 100.09,107.33 100.28,107.14 v107.9,107.14
  Bottom 0.152: 137.06,110.8 v137.21,110.64 137.52,110.34 140.21,110.34 141.28,111.4 141.28,115.37 141.88,115.98 141.88,117.81 141.28,118.42 119.18,118.42 v107.9,107.14
A0_1_4  (via drill 0.41)
  Top 0.152: U$15.P$20 136.28,100.11 136.75,100.58 v137.36,100.58 | U1.12 95.58,109.44 97.23,111.1 100.04,111.1 R12.2 100.09,109.92 100.28,109.73 109.73,109.73 110.8,108.66 v110.8,105.77
  Bottom 0.152: 137.36,100.74 v137.36,100.58 136.45,99.67 118.72,99.67 112.62,105.77 v110.8,105.77
A0_1_5  (via drill 0.41)
  Top 0.152: U$18.P$20 147.71,90.05 148.34,90.68 v148.79,90.68 | U1.7 96.88,97.44 97.08,97.23 98.15,97.23 98.45,97.54 98.45,100.13 99.06,100.74 99.88,100.74 R13.2 99.93,99.71 100.08,99.57 v105.41,99.57
  Bottom 0.152: 148.95,90.68 v148.79,90.68 149.3,90.17 150.37,90.17 150.88,90.68 150.88,96.27 150.11,97.03 112.78,97.03 110.24,99.57 v105.41,99.57
A0_1_6  (via drill 0.41)
  Top 0.152: U$19.P$20 148.59,79.35 v149.1,79.86 | U1.6 96.22,97.02 96.62,96.62 98.75,96.62 99.21,97.08 99.21,98.15 99.36,98.3 99.88,98.3 R14.2 99.93,97.17 100.08,97.03 v104.14,97.03 | v109.22,97.03 v109.22,90.93 | v115.32,80.01 123.44,80.01 v125.73,77.72
  Bottom 0.152: 148.95,80.01 v149.1,79.86 149.61,79.35 149.61,78.99 148.08,77.47 130.81,77.47 130.56,77.72 v125.73,77.72 | v104.14,97.03 v109.22,97.03 | v115.32,80.01 115.06,80.26 115.06,83.82 114.05,84.84 111.51,84.84 110.49,85.85 110.49,90.42 109.98,90.93 v109.22,90.93
A0_1_7  (via drill 0.41)
  Top 0.152: U$20.P$20 137.26,89.51 v137.52,89.76 | U1.5 95.58,96.6 96.47,95.71 R15.2 99.93,94.63 100.08,94.49 v104.14,94.49 | v127.25,94.49 128.52,94.49 129.54,93.47 129.54,88.39 130.05,87.88 v130.56,87.88
  Bottom 0.152: 137.36,89.92 v137.52,89.76 138.43,88.85 138.43,88.65 137.67,87.88 v130.56,87.88 | v104.14,94.49 113.28,94.49 113.79,93.98 117.09,93.98 117.6,94.49 v127.25,94.49
A0_1_8  (via drill 0.41)
  Top 0.152: U$21.P$20 137.16,79.35 v137.36,79.55 | U1.4 94.92,94.81 96.62,93.12 99.88,93.12 R16.2 99.93,92.34 100.33,91.95 104.39,91.95 v104.65,91.69
  Bottom 0.152: 137.21,79.7 v137.36,79.55 137.41,79.5 137.41,78.74 136.91,78.23 126.75,78.23 124.71,80.26 117.86,80.26 116.33,81.79 116.33,83.82 114.55,85.6 111.76,85.6 111,86.36 111,91.44 110.24,92.2 108.46,92.2 107.95,91.69 v104.65,91.69
A0_1_9  (via drill 0.41)
  Top 0.152: U$24.P$20 148.34,69.19 v149.1,69.95 | U2.9 100.06,48.25 100.33,48.51 101.09,48.51 101.35,48.26 101.35,45.97 101.85,45.47 R17.2 103.49,44.85 103.89,44.45 v111.76,44.45 | v111.76,28.96 v152.65,28.96
  Bottom 0.152: 148.79,69.95 v149.1,69.95 152.65,66.4 v152.65,28.96 | v111.76,44.45 v111.76,28.96
A0_1_10  (via drill 0.41)
  Top 0.152: U$25.P$20 148.69,59.03 v149.25,59.59 | U2.10 99.42,48.62 99.82,49.02 101.35,49.02 102.36,48.01 R18.2 103.49,47.39 104.14,46.74 v109.22,46.74 | v109.22,31.75 144.53,31.75 145.8,33.02 147.32,33.02 148.59,31.75 151.64,31.75 v151.89,32
  Bottom 0.152: 149.1,59.74 v149.25,59.59 152.15,56.69 152.15,43.69 151.89,43.43 v151.89,32 | v109.22,46.74 v109.22,31.75
A0_1_11  (via drill 0.41)
  Top 0.152: U$26.P$20 137.06,69.19 137.47,69.6 v140.21,69.6 | U2.11 98.77,48.73 100.58,50.55 R19.2 103.49,49.67 103.89,49.28 112.01,49.28 v113.03,48.26 | v113.03,35.05 141.22,35.05 v141.48,35.31
  Bottom 0.152: v113.03,48.26 v113.03,35.05 | v141.48,35.31 141.48,37.85 140.97,38.35 140.97,68.83 v140.21,69.6
A0_1_12  (via drill 0.41)
  Top 0.152: U$27.P$20 137.26,59.03 v137.67,59.44 | U2.12 98.11,48.84 102.36,53.09 R20.2 103.49,51.96 103.89,51.56 v108.2,51.56 | v108.2,59.44 v127.25,59.44
  Bottom 0.152: 137.36,59.44 v137.67,59.44 137.92,59.18 137.92,58.42 137.67,58.17 128.27,58.17 127.25,59.18 v127.25,59.44 | v108.2,51.56 v108.2,59.44
A0_1_13  (via drill 0.41)
  Top 0.152: U$30.P$20 148.59,48.87 v149.1,49.38 | U2.7 99.42,40.03 99.57,39.88 100.84,39.88 101.09,40.13 101.09,42.16 101.85,42.93 R21.2 103.49,42.31 104.14,41.66 v114.55,41.66 | v114.55,30.73 144.78,30.99 145.8,32 147.57,32 148.84,30.73 150.88,30.73 v151.13,30.48
  Bottom 0.152: 148.79,49.53 148.95,49.38 v149.1,49.38 149.86,48.62 149.86,42.93 151.13,41.66 v151.13,30.48 | v114.55,41.66 v114.55,30.73
A0_1_14  (via drill 0.41)
  Top 0.152: U$31.P$20 148.64,38.71 v148.79,38.86 | U2.6 98.77,39.16 99.06,38.86 101.6,38.86 102.11,39.37 102.11,40.13 102.36,40.39 R22.2 103.49,39.77 104.14,39.12 v111,39.12 | v111,34.29 v148.84,34.29
  Bottom 0.152: 148.79,39.01 v148.79,38.86 148.84,38.81 v148.84,34.29 | v111,39.12 v111,34.29
A0_1_15  (via drill 0.41)
  Top 0.152: U$32.P$20 137.62,48.87 v138.12,49.38 | U2.5 98.11,38.54 98.81,37.85 R23.2 103.49,36.46 103.63,36.32 139.19,36.32 v139.45,36.07
  Route2 0.152: v138.12,49.38 137.97,49.38
  Bottom 0.152: v139.45,36.07 139.45,42.67 140.21,43.43 140.21,48.26 138.94,49.53 138.28,49.53 v138.12,49.38
A0_1_16  (via drill 0.41)
  Top 0.152: U$33.P$20 137.36,38.71 v137.67,39.01 | U2.4 97.47,37.16 99.31,35.31 R24.2 103.49,33.42 104.14,32.77 v138.18,32.77
  Bottom 0.152: 137.52,39.01 v137.67,39.01 138.18,38.51 v138.18,32.77
A0_2_1  (via drill 0.41)
  Top 0.152: U$16.P$20 126.11,105.49 126.39,105.77 v127.15,105.77 | U3.7 93.06,74.32 93.47,73.91 94.49,73.91 94.74,74.17 94.74,76.2 95.25,76.71 R25.2 96.38,78.85 v103.63,86.11 | v108.71,86.36 112.78,86.36 v113.03,86.61 | v113.03,91.95 113.03,96.27 117.86,101.09 118.87,101.09 v121.41,103.63
  Bottom 0.152: 127.15,105.61 v127.15,105.77 126.14,104.75 U$16.P$20 125,103.63 v121.41,103.63 | v103.63,86.11 107.95,86.11 108.2,86.36 v108.71,86.36 | v113.03,86.61 v113.03,91.95
A0_2_2  (via drill 0.41)
  Top 0.152: U$22.P$20 127.15,84.43 v127.46,84.73 | U3.6 92.42,73.95 92.96,73.41 95,73.41 95.76,74.17 R26.2 96.38,73.04 96.52,72.9 v98.3,72.9 | v121.16,72.9 121.16,78.74 120.4,79.5 116.84,79.5 116.08,78.74 115.06,78.74 114.05,79.76 114.05,80.26 114.55,80.77 126.24,80.77 v127,80.01 | v115.57,85.85 v118.62,85.85
  Bottom 0.152: 127.31,84.89 v127.46,84.73 125.53,82.8 121.16,82.8 118.62,85.34 v118.62,85.85 | v98.3,72.9 v121.16,72.9 | v127,80.01 126.24,80.77 118.87,80.77 116.84,82.8 116.84,84.58 v115.57,85.85
A0_2_3  (via drill 0.41)
  Top 0.152: U$28.P$20 126.8,64.11 127.15,64.47 v127.15,64.92 | U3.5 91.77,72.57 92.71,71.63 R27.2 96.38,70.5 96.52,70.36 v99.06,70.36
  Bottom 0.152: 127,64.92 v127.15,64.92 126.49,65.58 126.49,67.06 125.98,67.56 125.48,67.56 124.71,66.8 123.95,66.8 123.44,67.31 120.4,67.31 117.35,70.36 v99.06,70.36
A0_2_4  (via drill 0.41)
  Top 0.152: U3.4 91.11,70.68 92.71,69.09 R28.2 96.38,67.96 96.52,67.82 v98.55,67.82 | v104.39,67.82 104.39,60.45 118.36,46.48 124.71,46.48 125.48,47.24 126.24,47.24 126.49,46.99 126.49,44.2 126.11,43.82 U$34.P$20
  Bottom 0.152: v98.55,67.82 v104.39,67.82
A0_3_1  (via drill 0.41)
  Top 0.152: v111,74.68 110.59,74.27 U$35.P$20 109.61,73.63 109.78,73.46 113.74,73.46 114.35,74.07 114.35,75.5 R99.2 | v92.2,123.95 92.58,123.95 92.96,124.33 92.96,124.46 93.98,125.48 98.55,125.48 v98.81,125.22
  Route15 0.152: v102.87,120.02 103,120.02 105.03,117.98 105.03,116.33 104.14,115.44 104.14,105.28 103.76,104.9 103.76,97.79 103,97.03 103,96.65 104.14,95.5 104.9,95.5 105.41,95 105.41,80.26 105.66,80.01 105.66,77.22 104.78,76.33 104.78,73.91 105.03,73.66 109.98,73.66 v111,74.68
  Bottom 0.152: v111,74.68 110.85,74.83 | U$4.P29 74.12,120.95 73.79,121.28 73.79,122.15 74.55,122.81 74.55,123.95 74.93,124.33 91.95,124.33 92.2,124.08 v92.2,123.95 92.2,123.57 | v98.81,125.22 98.81,124.97 102.87,120.9 v102.87,120.02
A1_1_1  (via drill 0.41)
  Top 0.152: U4.9 81.02,105.65 81.28,105.92 81.79,105.92 82.04,105.66 82.04,103.63 82.3,103.38 R29.2 83.42,102.5 83.82,102.11 v86.61,102.11 | v106.68,101.35 108.2,101.35 127,120.14 127.25,120.14 130.3,123.19 147.57,123.19 150.62,120.14 151,119.76 v152.15,118.62
  Top 0.305: U$8.P$19 147.06,111.65 v147.12,111.71
  Bottom 0.152: v86.61,102.11 103.38,102.11 104.39,101.09 106.43,101.09 v106.68,101.35 | v152.15,118.62 152.15,113.79 151.64,113.28 148.69,113.28 v147.12,111.71
  Bottom 0.305: v147.12,111.71 146.96,111.86
A1_1_2  (via drill 0.41)
  Top 0.152: 147.06,101.13 U$13.P$19 147.06,101.51 v146.46,102.11 | U4.10 80.36,106.27 80.52,106.43 82.04,106.43 82.55,105.92 R30.2 83.42,105.04 83.82,104.65 v87.12,104.65 | v104.9,103.38 109.22,103.38 v109.98,104.14
  Bottom 0.152: 146.3,102.11 v146.46,102.11 146.2,102.36 142.24,102.36 139.19,99.31 114.3,99.31 109.98,103.63 v109.98,104.14 | v87.12,104.65 90.42,104.65 92.46,102.62 103.38,102.62 104.14,103.38 v104.9,103.38
A1_1_3  (via drill 0.41)
  Top 0.152: U$14.P$19 135.62,111.72 135.48,111.86 135.48,113.39 v135.64,113.54 135.64,113.28 | U4.11 79.72,107.91 80.01,108.2 83.17,108.2 R31.2 83.42,107.58 83.82,107.19 v87.12,107.19 | v131.57,120.65 v131.57,117.6
  Bottom 0.152: v87.12,107.19 91.44,107.19 92.2,107.95 102.11,107.95 102.87,107.19 104.39,107.19 117.6,120.4 131.32,120.4 v131.57,120.65 | v131.57,117.6 138.68,117.6 139.19,117.09 139.19,114.05 138.94,113.79 135.89,113.79 v135.64,113.54
A1_1_4  (via drill 0.41)
  Top 0.152: U$15.P$19 135.62,101.81 v135.18,102.26 | U4.12 79.06,109.04 81.03,111 R32.2 83.42,110.12 83.82,109.73 v87.63,109.73 | v108.2,112.78 110.74,112.78 v114.55,108.97
  Bottom 0.152: 135.03,102.26 v135.18,102.26 135.62,101.81 135.62,100.84 135.12,100.33 121.41,100.33 114.55,107.19 v114.55,108.97 | v87.63,109.73 91.44,109.73 93.98,112.27 107.7,112.27 v108.2,112.78
A1_1_5  (via drill 0.41)
  Top 0.152: U$18.P$19 147.06,91.99 v147.27,92.2 144.27,92.2 143.76,92.71 v140.97,92.71 | U4.7 80.36,96.67 80.77,96.27 81.28,96.27 81.79,96.77 81.79,100.33 82.3,100.84 R33.2 83.42,99.96 83.82,99.57 v87.63,99.57
  Bottom 0.152: v147.27,92.2 147.12,92.2 | v87.63,99.57 103.12,99.57 104.65,98.04 110.49,98.04 112.01,96.52 140.72,96.52 140.97,96.27 v140.97,92.71
A1_1_6  (via drill 0.41)
  Top 0.152: U$19.P$19 147.06,81.47 v147.27,81.69 | U4.6 79.72,96.31 80.26,95.76 81.28,95.76 82.3,96.77 82.3,98.04 82.55,98.3 R34.2 83.42,97.17 83.57,97.03 86.36,97.03 87.63,95.76 87.63,94.49 89.66,92.46 96.77,92.46 v97.54,91.69
  Bottom 0.152: 147.12,81.69 v147.27,81.69 147.06,81.47 147.06,81.03 147.31,80.77 150.11,80.77 151.13,79.76 151.13,79.25 148.59,76.71 128.52,76.71 128.27,76.96 126.49,76.96 126.24,76.71 125.48,76.71 122.68,79.5 118.11,79.5 117.35,78.74 115.32,78.74 113.28,80.77 113.28,82.3 112.52,83.06 105.41,83.06 99.57,88.9 98.3,88.9 98.3,90.68 97.54,91.44 v97.54,91.69
A1_1_7  (via drill 0.41)
  Top 0.152: U$20.P$19 135.62,91.38 v135.84,91.59 | U4.5 79.06,95.69 79.5,95.25 82.92,95.25 R35.2 83.42,94.63 83.57,94.49 87.12,94.49 89.66,91.95 95.76,91.95 97.54,90.17 102.87,90.17 v103.12,90.42 | v106.93,90.42 106.93,93.22 v107.19,93.47
  Bottom 0.152: 135.99,91.44 v135.84,91.59 135.62,91.38 135.62,90.42 134.61,89.41 126.49,89.41 126.49,93.22 126.24,93.47 v107.19,93.47 | v103.12,90.42 v106.93,90.42
A1_1_8  (via drill 0.41)
  Top 0.152: U$21.P$19 135.62,81.17 v135.84,81.38 | U4.4 78.42,93.54 78.74,93.22 R36.2 83.42,91.84 84.07,91.19 95,91.19 96.52,89.66 103.89,89.66 v104.39,89.15 | v108.71,84.07 v117.6,84.07
  Bottom 0.152: v135.84,81.38 135.69,81.38 | v104.39,89.15 107.7,89.15 108.71,88.14 109.73,88.14 109.98,87.88 109.98,84.58 109.47,84.07 v108.71,84.07 | v117.6,84.07 117.6,83.44 119.38,81.53 130.3,81.53 130.56,81.79 135.43,81.79 v135.84,81.38 | 135.69,81.53 v135.84,81.38
A1_1_9  (via drill 0.41)
  Top 0.152: U$24.P$19 147.06,71.26 v147.12,71.32 | U5.9 83.05,48.25 83.31,48.51 84.07,48.51 84.33,48.26 84.33,44.96 84.58,44.7 R37.2 86.73,43.32 86.87,43.18 90.93,43.18 v91.69,42.42 | v93.73,23.37 153.16,23.37 153.92,22.61 155.45,22.61 v156.21,23.37
  Bottom 0.152: 146.81,71.32 v147.12,71.32 147.83,70.61 150.11,70.61 150.88,71.37 153.67,71.37 156.21,68.83 v156.21,23.37 | v91.69,42.42 91.69,41.4 92.71,40.39 92.71,36.83 93.22,36.32 93.22,34.8 92.71,34.29 92.71,25.91 93.22,25.4 93.22,23.88 v93.73,23.37
A1_1_10  (via drill 0.41)
  Top 0.152: U$25.P$19 147.06,60.9 v147.27,61.11 | U5.10 82.4,48.62 82.8,49.02 84.58,49.02 84.84,48.77 84.84,47.5 85.09,47.24 R38.2 86.73,46.12 86.87,45.97 90.17,45.97 v90.42,46.23 | v89.41,29.46 110.24,29.46 110.49,29.72 113.03,29.72 113.28,29.46 145.8,29.46 v146.3,29.97
  Bottom 0.152: 147.12,61.11 v147.27,61.11 147.07,60.91 147.07,42.42 145.54,40.89 145.54,39.62 146.3,38.86 v146.3,29.97 | v90.42,46.23 91.44,46.23 92.96,44.7 92.96,43.94 92.2,43.18 91.44,43.18 90.93,42.67 90.93,39.37 89.92,38.35 89.92,38.1 90.17,37.85 90.42,37.85 90.68,37.59 90.68,30.73 v89.41,29.46
A1_1_11  (via drill 0.41)
  Top 0.152: U$26.P$19 135.62,71.11 v135.69,71.17 | U5.11 81.75,48.73 82.8,49.78 R39.2 86.73,50.4 87.12,50.8 89.92,50.8 90.17,51.05 v90.17,57.15 | v121.67,60.2 124.97,60.2 v125.98,61.21
  Bottom 0.152: 135.53,71.17 v135.69,71.17 135.62,71.11 U$26.P$19 136.24,68.58 138.43,68.58 139.57,67.44 139.57,64.64 140.21,64.01 140.21,63.25 139.7,62.74 135.38,62.74 133.86,61.21 v125.98,61.21 | v90.17,57.15 104.39,57.15 107.44,60.2 v121.67,60.2
A1_1_12  (via drill 0.41)
  Top 0.152: U$27.P$19 135.62,61.2 v135.69,61.27 | U5.12 81.1,48.84 84.58,52.32 R40.2 86.73,58.05 v86.61,58.17 | v120.4,61.21 121.92,61.21 122.43,61.72 123.44,61.72 v123.95,61.21
  Bottom 0.152: 135.53,61.27 v135.69,61.27 135.62,61.2 U$27.P$19 135.52,58.93 130.05,58.93 128.52,60.45 127.25,60.45 126.49,59.69 125.22,59.69 123.95,60.96 v123.95,61.21 | v86.61,58.17 104.39,58.17 107.44,61.21 v120.4,61.21
A1_1_13  (via drill 0.41)
  Top 0.152: U5.7 82.4,40.28 82.55,40.13 85.09,40.13 85.34,40.39 85.34,41.91 85.6,42.16 R41.2 86.73,41.29 87.12,40.89 93.47,40.89 v94.49,39.88 | v95.5,24.13 v154.43,24.13 | v154.43,54.36 154.43,54.1 150.62,50.29 147.83,50.29 147.06,49.52 U$30.P$19
  Bottom 0.152: v94.49,39.88 94.49,27.69 95.76,26.42 95.76,24.38 v95.5,24.13 | v154.43,24.13 v154.43,54.36
A1_1_14  (via drill 0.41)
  Top 0.152: U$31.P$19 147.06,40.78 v147.12,40.84 | U5.6 81.75,39.92 82.04,39.62 R42.2 86.73,38.75 87.12,38.35 v91.19,38.35 | v91.19,27.94 141.99,27.94 142.49,28.45 145.8,28.45 146.3,27.94 v147.57,27.94
  Bottom 0.152: 147.27,40.84 v147.12,40.84 147.57,40.39 v147.57,27.94 | v91.19,38.35 v91.19,27.94
A1_1_15  (via drill 0.41)
  Top 0.152: U5.5 81.1,37.77 81.79,37.08 R43.2 86.73,36.21 87.12,35.81 v92.2,35.81 | v92.2,25.15 143,25.15 v143.26,25.4 | v142.24,52.32 140.46,52.32 139.7,51.56 139.7,50.8 139.19,50.29 136.14,50.29 135.62,49.77 U$32.P$19
  Bottom 0.152: v92.2,35.81 v92.2,25.15 | v143.26,25.4 143.26,37.08 141.48,38.86 141.48,51.56 v142.24,52.32
A1_1_16  (via drill 0.41)
  Top 0.152: U$33.P$19 135.62,40.48 v135.84,40.69 | U5.4 80.45,36.39 82.3,34.54 R44.2 86.73,33.42 87.38,32.77 v93.73,32.77 | v93.98,26.67 v135.89,26.67
  Bottom 0.152: 135.69,40.84 v135.84,40.69 135.89,40.64 v135.89,26.67 | v93.73,32.77 93.73,26.92 v93.98,26.67
A1_2_1  (via drill 0.41)
  Top 0.152: U$16.P$19 125.47,105.6 125.78,105.92 125.78,107.29 v125.63,107.44 | U6.7 78.84,74.58 79.25,74.17 80.52,74.17 81.03,74.68 81.03,76.2 81.28,76.45 R45.2 82.66,75.33 82.8,75.18 86.11,75.18 86.61,75.69 86.61,78.49 87.38,79.25 89.66,79.25 90.68,78.23 90.93,78.23 91.69,78.99 v93.47,78.99 | v109.73,88.9 116.84,88.9 v117.35,89.41 | v117.6,91.95 117.6,94.23 v125.48,101.85
  Bottom 0.152: 125.48,107.44 v125.63,107.44 125.48,107.59 125.48,108.2 125.98,108.71 128.52,108.71 128.52,105.16 128.27,104.9 127.51,104.9 125.48,102.87 v125.48,101.85 | v93.47,78.99 93.73,78.99 97.03,82.3 97.03,89.92 96.52,90.42 96.52,91.69 97.28,92.46 98.04,92.46 98.55,91.95 98.55,91.69 99.57,90.68 101.35,90.68 102.36,89.66 103.89,89.66 104.14,89.92 106.17,89.92 106.43,89.66 108.97,89.66 v109.73,88.9 | v117.35,89.41 117.35,91.69 v117.6,91.95
A1_2_2  (via drill 0.41)
  Top 0.152: U$22.P$19 125.47,86.86 v125.48,86.87 | U6.6 78.19,73.95 78.49,73.66 82.41,73.66 R46.2 82.66,73.04 83.06,72.64 v87.38,72.64 | v142.24,83.31 141.73,83.82 140.97,83.82 140.21,83.06 140.21,81.03 139.7,80.52 137.16,80.52 136.91,80.77 136.91,81.79 136.4,82.3 131.32,82.3 127.25,78.23 127.25,75.69 v127,75.44
  Bottom 0.152: 125.32,86.87 v125.48,86.87 125.47,86.86 125.47,86.36 125.97,85.85 128.27,85.85 129.03,86.61 132.08,86.61 132.84,87.38 140.72,87.38 140.97,87.12 140.97,83.82 141.48,83.31 v142.24,83.31 | v87.38,72.64 96.01,72.64 96.52,72.14 98.81,72.14 99.06,72.39 119.38,72.39 120.14,71.63 122.68,71.63 v127,75.44
A1_2_3  (via drill 0.41)
  Top 0.152: U$28.P$19 125.47,66.44 v125.48,66.45 | U6.5 77.54,71.81 77.98,71.37 R47.2 82.66,70.25 82.8,70.1 v87.63,70.1
  Bottom 0.152: 125.63,66.45 v125.48,66.45 125.45,66.42 124.08,66.42 123.95,66.29 123.7,66.29 123.19,66.8 119.63,66.8 117.6,68.83 103.89,68.83 103.38,68.33 99.06,68.33 98.81,68.58 98.04,68.58 97.79,68.33 96.77,68.33 95,70.1 v87.63,70.1
A1_2_4  (via drill 0.41)
  Top 0.152: U$34.P$19 125.47,45.86 v125.63,46.02 125.58,45.97 120.14,45.97 119.89,45.72 118.11,45.72 102.87,60.96 v102.87,66.55 | U6.4 76.89,70.94 78.99,68.83 R48.2 82.66,67.71 83.06,67.31 v86.87,67.31
  Bottom 0.152: v125.63,46.02 125.48,46.02 | v102.87,66.55 97.28,66.55 95.5,68.33 87.88,68.33 v86.87,67.31
A1_3_1  (via drill 0.41)
  Top 0.152: v109.17,76.2 108.95,75.99 U$35.P$19 108.95,73.21 109.32,72.85 117.55,72.85 118.16,73.46 118.16,75.5 R100.2
  Route15 0.152: U$4.P31 72.52,117.9 73.28,117.14 77.37,117.14 77.95,117.73 80.64,117.73 v82.25,116.13 | v90.63,115.01 90.63,114.71 90.58,114.66 90.58,92.38 103.05,79.91 103.05,73.94 104.27,72.72 110.59,72.72 112.7,74.83 112.7,75.23 112.32,75.62 109.75,75.62 v109.17,76.2
  Bottom 0.152: v109.17,76.2 109.17,76.35 | v82.25,116.13 83.24,116.13 84.15,115.21 90.42,115.21 v90.63,115.01
CDRIVE  (via drill 0.41)
  Top 0.152: U$4.P34 68.45,119.5 61.72,112.78 57.91,112.78 57.15,112.01 57.15,110.74 57.4,110.49 57.4,109.22 57.15,108.97 57.15,68.33 59.18,66.29 81.79,66.04 82.55,66.8 84.84,66.8 85.34,66.29 96.52,66.29 96.77,66.04 96.77,64.52 97.28,64.01 98.34,64.01 U$9.P$2
  Top 0.254: U$9.P$2 100.4,63.94 v100.84,63.5
  Bottom 0.254: v100.84,63.5 101.09,63.5
CS1
  Top 0.152: U1.16 91.57,104.42 90.83,105.16 90.83,112.01 92.66,113.84 103.02,113.84 105.61,116.43 105.61,118.87 100.13,124.36 97.48,124.36 U$4.P35
CS2  (via drill 0.41)
  Top 0.152: U2.16 95.52,47.49 94.74,48.26 93.98,48.26 93.47,48.77 v93.47,55.88 | v51.82,55.88 v51.82,62.48 | v51.82,65.28 51.82,75.18 46.99,80.01 v46.99,110.74 | v46.48,114.05 46.48,116.84 48.01,118.36 v57.66,118.36
  Bottom 0.152: v93.47,55.88 v51.82,55.88 | v51.82,62.48 v51.82,65.28 | v46.99,110.74 46.99,113.54 v46.48,114.05 | v57.66,118.36 58.67,118.36 65.53,125.22 93.73,125.22 94.49,124.46 94.49,123.03 U$4.P37
CS3  (via drill 0.41)
  Top 0.152: U3.16 89.13,81.05 88.39,81.79 87.12,81.79 86.36,82.55 86.36,88.14 85.85,88.65 v58.17,88.65 | v54.1,88.39 v54.1,112.52
  Bottom 0.152: v58.17,88.65 54.36,88.65 v54.1,88.39 | v54.1,112.52 54.1,113.03 65.79,124.71 93.22,124.71 93.73,124.21 U$4.P38
CS4  (via drill 0.41)
  Top 0.152: U4.16 74.65,104.42 74.42,104.65 74.42,111.76 75.18,112.52 85.34,112.52 89.15,116.46 89.66,116.97 v89.92,116.97
  Bottom 0.152: v89.92,116.97 91.69,118.87 91.69,119.69 92.46,120.4 92.46,121.51 U$4.P40
CS5  (via drill 0.41)
  Top 0.152: U5.16 76.68,47.27 76.45,47.5 v76.45,57.66 | v49.28,57.66 v49.28,61.98 | v49.28,65.02 49.28,76.96 46.48,79.76 46.48,108.71 v45.47,109.73
  Route15 0.152: v45.72,120.14 67.56,120.14 68.33,120.9 68.33,124.71 69.09,125.48 90.68,125.48 91.44,124.71 91.44,123.12 U$4.P41
  Bottom 0.152: v76.45,57.66 v49.28,57.66 | v49.28,61.98 v49.28,65.02 | v45.47,109.73 45.47,113.03 44.7,113.79 44.7,119.13 v45.72,120.14
CS6  (via drill 0.41)
  Top 0.152: U6.16 73.38,81.56 71.37,83.57 71.37,87.38 58.67,87.38 v58.42,87.12 | v52.58,87.12 52.58,112.01 v52.32,112.27 | v54.61,115.82 56.64,115.82 66.29,125.48 89.15,125.48 89.66,124.97 89.66,123.06 U$4.P43
  Bottom 0.152: v58.42,87.12 v52.58,87.12 | v52.32,112.27 52.32,113.54 v54.61,115.82
CS7  (via drill 0.41)
  Top 0.152: U7.16 61.23,105.4 61.21,105.41 60.45,105.41 v60.2,105.16 | v88.39,118.36 88.39,118.62 88.52,118.75 88.52,119.74 89.28,120.4 89.28,121.49 U$4.P44
  Bottom 0.152: v60.2,105.16 64.26,105.16 64.77,105.66 64.77,110.24 68.07,113.54 68.58,113.54 70.1,115.06 70.1,115.57 80.03,115.57 81.81,117.35 83.67,117.35 85.45,115.57 86.36,115.57 88.39,117.6 v88.39,118.36
CS8  (via drill 0.41)
  Top 0.152: U8.16 62.76,47.02 v62.74,46.99 | v45.97,46.99 v45.97,59.69 | v45.97,63.25 45.97,78.23 45.47,78.74 45.47,107.19 v44.45,108.2 | v43.43,110.74 43.43,120.65 44.2,121.41 48.26,121.41 v50.29,119.38
  Route15 0.152: v50.29,119.38 67.56,119.38 68.83,120.65 68.83,123.95 69.09,124.21 87.12,124.21 87.38,123.95 87.38,121.91 U$4.P46
  Bottom 0.152: v62.74,46.99 v45.97,46.99 | v45.97,59.69 v45.97,63.25 | v44.45,108.2 44.45,108.46 43.43,109.47 v43.43,110.74
CS9  (via drill 0.41)
  Top 0.152: U9.16 57.94,81.56 v57.91,81.53 | v50.55,81.53 v50.55,112.52 | v50.8,114.55 56.64,114.55 66.8,124.71 86.11,124.71 86.61,124.21 86.61,123.09 U$4.P47
  Bottom 0.152: v57.91,81.53 v50.55,81.53 | v50.55,112.52 50.55,114.3 v50.8,114.55
ENB_1_1  (via drill 0.41)
  Top 0.152: U7.9 65.78,105.65 66.04,105.92 66.55,105.92 66.8,105.66 66.8,103.89 67.31,103.38 R52.2 68.18,104.25 68.33,104.39 v72.64,104.39 | v154.69,115.82 150.37,115.82 149.96,116.23 U$8.P$1
  Bottom 0.152: v72.64,104.39 83.06,104.39 83.57,104.9 83.57,106.68 87.63,110.74 91.69,110.74 93.98,113.03 107.19,113.03 108.97,114.81 111,114.81 117.35,121.16 127,121.16 127.76,121.92 152.15,121.92 154.94,119.13 154.94,116.08 v154.69,115.82
ENB_1_2  (via drill 0.41)
  Top 0.152: U$13.P$1 148.64,106.07 v148.79,105.92 | U7.10 65.12,106.27 65.28,106.43 67.68,106.43 R53.2 68.18,107.05 68.33,107.19 v72.64,107.19
  Bottom 0.152: 148.95,106.07 v148.79,105.92 151.89,105.92 155.7,109.73 155.7,119.63 152.15,123.19 128.27,123.19 126.75,121.67 117.09,121.67 116.08,120.65 114.05,120.65 106.93,113.54 93.73,113.54 91.69,111.51 87.63,111.51 87.38,111.76 86.11,111.76 85.6,111.25 85.6,109.73 81.28,105.41 75.18,105.41 73.41,107.19 v72.64,107.19
ENB_1_3  (via drill 0.41)
  Top 0.152: U$14.P$1 137.11,116.23 v137.21,116.13 | U7.11 64.47,107.66 65.28,108.46 R54.2 68.18,109.08 68.58,109.47 v72.64,109.47 | v106.93,114.55 115.82,114.55 v118.11,112.27
  Bottom 0.152: 137.06,116.13 v137.21,116.13 137.01,116.33 125.98,116.33 121.92,112.27 v118.11,112.27 | v72.64,109.47 83.06,109.47 85.85,112.27 91.19,112.27 93.22,114.3 106.68,114.3 v106.93,114.55
ENB_1_4  (via drill 0.41)
  Top 0.152: U$15.P$1 137.21,106.07 v137.36,105.92 | U7.12 63.83,108.53 66.04,110.74 67.93,110.74 R55.2 68.18,111.62 68.83,112.27 v72.39,112.27 | v105.66,115.06 105.66,113.79 106.17,113.28 107.44,113.28 107.95,113.79 113.28,113.79 v116.33,110.74 | v130.81,102.36 v130.81,103.76
  Bottom 0.152: 137.36,106.07 v137.36,105.92 136.14,104.7 136.14,104.27 135.64,103.76 v130.81,103.76 | v72.39,112.27 81.53,112.27 84.07,114.81 89.15,114.81 90.68,113.28 91.44,113.28 93.22,115.06 v105.66,115.06 | v116.33,110.74 116.33,107.44 122.94,100.84 129.29,100.84 v130.81,102.36
ENB_1_5  (via drill 0.41)
  Top 0.152: U$18.P$1 148.74,95.91 v148.79,95.86 | U7.7 65.12,96.93 65.28,96.77 66.55,96.77 66.55,100.08 67.31,100.84 R56.2 68.18,99.96 68.33,99.82 72.14,99.82 73.41,98.55 73.41,95.76 74.68,94.49 74.68,93.47 75.95,92.2 80.77,92.2 v81.03,92.46
  Bottom 0.152: 148.79,96.01 v148.79,95.86 147.68,94.74 146.05,94.74 144.78,93.47 143,93.47 142.75,93.22 142.75,92.46 141.99,91.69 140.46,91.69 140.21,91.95 140.21,95.76 139.95,96.01 138.68,96.01 138.43,95.76 138.43,93.47 137.92,92.96 134.87,92.96 134.62,92.71 130.05,92.71 129.79,92.96 129.79,93.73 128.02,95.5 126.24,95.5 125.73,95 117.6,95 117.09,94.49 114.55,94.49 114.05,95 107.19,95 106.43,95.76 104.14,95.76 102.87,94.49 97.28,94.49 95.25,92.46 v81.03,92.46
ENB_1_6  (via drill 0.41)
  Top 0.152: U$19.P$1 148.74,85.75 v148.79,85.65 | U7.6 64.47,96.81 65.02,96.27 66.8,96.27 67.31,96.77 67.31,98.04 67.56,98.3 R57.2 68.18,97.17 68.33,97.03 72.64,97.03 72.9,96.77 72.9,95.25 73.91,94.23 73.91,92.96 75.95,90.93 83.57,90.93 84.07,90.42 95.25,90.42 96.77,88.9 103.38,88.9 v104.65,87.63 | v106.68,87.88 106.68,88.14 108.46,89.92 108.46,95.25 v107.95,95.76 | v115.06,95.5 v115.06,91.69
  Bottom 0.152: 148.95,85.65 v148.79,85.65 148.59,85.45 148.59,84.58 146.56,82.55 135.64,82.55 135.25,82.17 133.22,82.17 133.1,82.3 130.56,82.3 130.3,82.04 120.9,82.04 115.06,87.88 v115.06,91.69 | v104.65,87.63 106.43,87.63 v106.68,87.88 | v107.95,95.76 114.81,95.76 v115.06,95.5
ENB_1_7  (via drill 0.41)
  Top 0.152: U$20.P$1 137.16,95.91 v137.36,95.71 | U7.5 63.83,96.45 64.52,95.76 R58.2 68.18,94.63 68.33,94.49 72.39,94.49 72.9,93.98 72.9,92.2 v73.41,91.69 | v125.48,92.71 125.48,95 125.73,95.25 129.03,95.25 v130.81,93.47
  Bottom 0.152: 137.36,95.86 v137.36,95.71 137.06,96.01 133.1,96.01 132.59,95.5 132.59,93.73 132.33,93.47 v130.81,93.47 | v73.41,91.69 95.5,91.69 96.77,92.96 98.3,92.96 99.82,91.44 102.87,91.44 104.65,93.22 105.41,93.22 106.17,92.46 108.2,92.46 108.46,92.71 v125.48,92.71
ENB_1_8  (via drill 0.41)
  Top 0.152: U$21.P$1 137.41,85.75 v137.52,85.65 | U7.4 63.17,94.56 64.52,93.22 R59.2 68.18,92.09 69.85,90.42 83.31,90.42 83.82,89.92 95,89.92 96.52,88.39 102.87,88.39 104.65,86.61 104.65,83.82 v103.63,82.8 | v112.52,80.01 113.03,80.01 114.3,81.28 129.54,81.28 130.3,82.04 130.3,83.06 130.56,83.31 131.83,83.31 v132.33,83.82
  Bottom 0.152: 137.52,85.5 v137.52,85.65 136.55,86.61 133.1,86.61 132.33,85.85 v132.33,83.82 | v103.63,82.8 104.9,82.8 105.16,82.55 112.01,82.55 112.52,82.04 v112.52,80.01
ENB_1_9  (via drill 0.41)
  Top 0.152: U$24.P$1 148.95,75.59 v149.1,75.44 | U8.9 68.57,47.49 69.09,48.01 69.6,48.01 69.85,47.75 69.85,44.7 70.61,43.94 R60.2 71.49,44.82 71.88,45.21 74.93,45.21 75.18,45.47 75.18,58.42 74.42,59.18 74.17,59.18 73.15,60.2 73.15,60.45 73.66,60.96 86.87,60.96 v88.65,59.18 | v116.08,62.48 116.33,62.48 v122.17,68.33
  Bottom 0.152: 148.79,75.44 v149.1,75.44 145.8,72.14 145.54,72.14 145.29,72.39 135.76,72.39 134.87,71.5 126.75,71.5 126.62,71.37 126.49,71.37 125.48,70.36 123.19,70.36 122.17,69.34 v122.17,68.33 | v88.65,59.18 98.3,59.18 98.81,59.69 104.9,59.69 107.7,62.48 v116.08,62.48
ENB_1_10  (via drill 0.41)
  Top 0.152: U$25.P$1 148.54,65.43 148.64,65.53 151.64,65.53 151.89,65.28 v151.89,64.77 | U8.10 67.92,48.11 68.33,48.51 70.1,48.51 70.36,48.26 70.36,46.74 70.61,46.48 R61.2 71.49,47.61 71.63,47.75 v73.41,47.75 | v76.2,43.94 76.2,41.91 76.96,41.15 76.96,39.12 77.47,38.61 77.47,31.75 78.74,30.48 v79.5,30.48 | v80.01,22.35 152.91,22.35 153.42,21.84 156.97,21.84 v157.73,22.61
  Route15 0.152: v153.92,73.15 153.92,66.8 v151.89,64.77
  Bottom 0.152: v73.41,47.75 74.93,47.75 76.45,46.23 76.45,44.2 v76.2,43.94 | v79.5,30.48 79.5,22.86 v80.01,22.35 | v157.73,22.61 157.73,64.52 157.48,64.77 157.48,69.6 v153.92,73.15
ENB_1_11  (via drill 0.41)
  Top 0.152: U$26.P$1 137.52,75.59 v137.67,75.44 | U8.11 67.27,48.47 67.82,49.02 R62.2 71.49,49.64 72.14,50.29 v73.91,50.29 | v72.9,53.85 72.9,59.69 72.64,59.94 72.64,61.47 v72.9,61.72
  Route15 0.152: v117.35,67.31 v117.35,73.66
  Bottom 0.152: 137.82,75.44 v137.67,75.44 136.91,76.2 126.49,76.2 126.24,75.95 125.98,75.95 124.21,74.17 119.89,74.17 119.38,73.66 v117.35,73.66 | v73.91,50.29 73.41,50.29 72.9,50.8 v72.9,53.85 | v72.9,61.72 72.9,65.28 71.63,66.55 71.63,67.82 71.88,68.07 71.88,70.61 72.14,70.87 73.41,70.87 74.93,69.34 79.76,69.34 80.26,69.85 86.11,69.85 86.87,69.09 95.5,69.09 97.54,67.06 101.85,67.06 102.11,67.31 103.12,67.31 103.89,66.55 116.59,66.55 v117.35,67.31
ENB_1_12  (via drill 0.41)
  Top 0.152: U$27.P$1 137.47,65.43 v137.67,65.23 | U8.12 66.62,50.11 68.07,51.56 R63.2 71.49,59.32 v69.85,60.96 | v84.07,62.23 v87.63,62.23
  Bottom 0.152: v69.85,60.96 82.8,60.96 v84.07,62.23 | v87.63,62.23 87.88,62.23 89.41,60.71 100.08,60.71 103.89,64.52 117.09,64.52 118.87,62.74 127,62.74 129.54,65.28 137.62,65.28 v137.67,65.23
ENB_1_13  (via drill 0.41)
  Top 0.152: U$30.P$1 149.2,55.27 149.3,55.37 151.64,55.37 152.15,55.88 152.91,55.88 153.16,56.13 v153.67,56.13 | U8.7 67.92,40.28 68.33,39.88 69.6,39.88 69.85,40.13 69.85,41.15 70.1,41.4 R64.2 71.49,40.27 71.88,39.88 v75.18,39.88 | v74.93,32.77 74.93,31.5 v74.17,30.73 | v74.17,27.18 93.22,27.18 93.47,27.43 95.76,27.43 96.01,27.18 135.13,27.18 135.38,27.43 143,27.43 143.51,27.94 145.54,27.94 146.3,27.18 152.91,27.18 v153.42,26.67
  Bottom 0.152: v75.18,39.88 75.18,33.02 v74.93,32.77 | v74.17,30.73 v74.17,27.18 | v153.42,26.67 153.42,27.69 153.67,27.94 v153.67,56.13
ENB_1_14  (via drill 0.41)